# EasyEDA Pro project ProPrj_ESP32S3R8N8 CAN Board_2026-01-26.epro

# Schematic Schematic

## Sheets
1 core: Board Name: LCSC ESP32S3R8N8 Dev Board V1.0.0; Create Date: 2026-01-01; Page Name: core; Project Name: ESP32S3R8N8 CAN Board; Schematic Name: Schematic; Update Date: 2026-01-02; Company: 嘉立创EDA; Page Size: A4; Reviewed: 嘉立创EDA
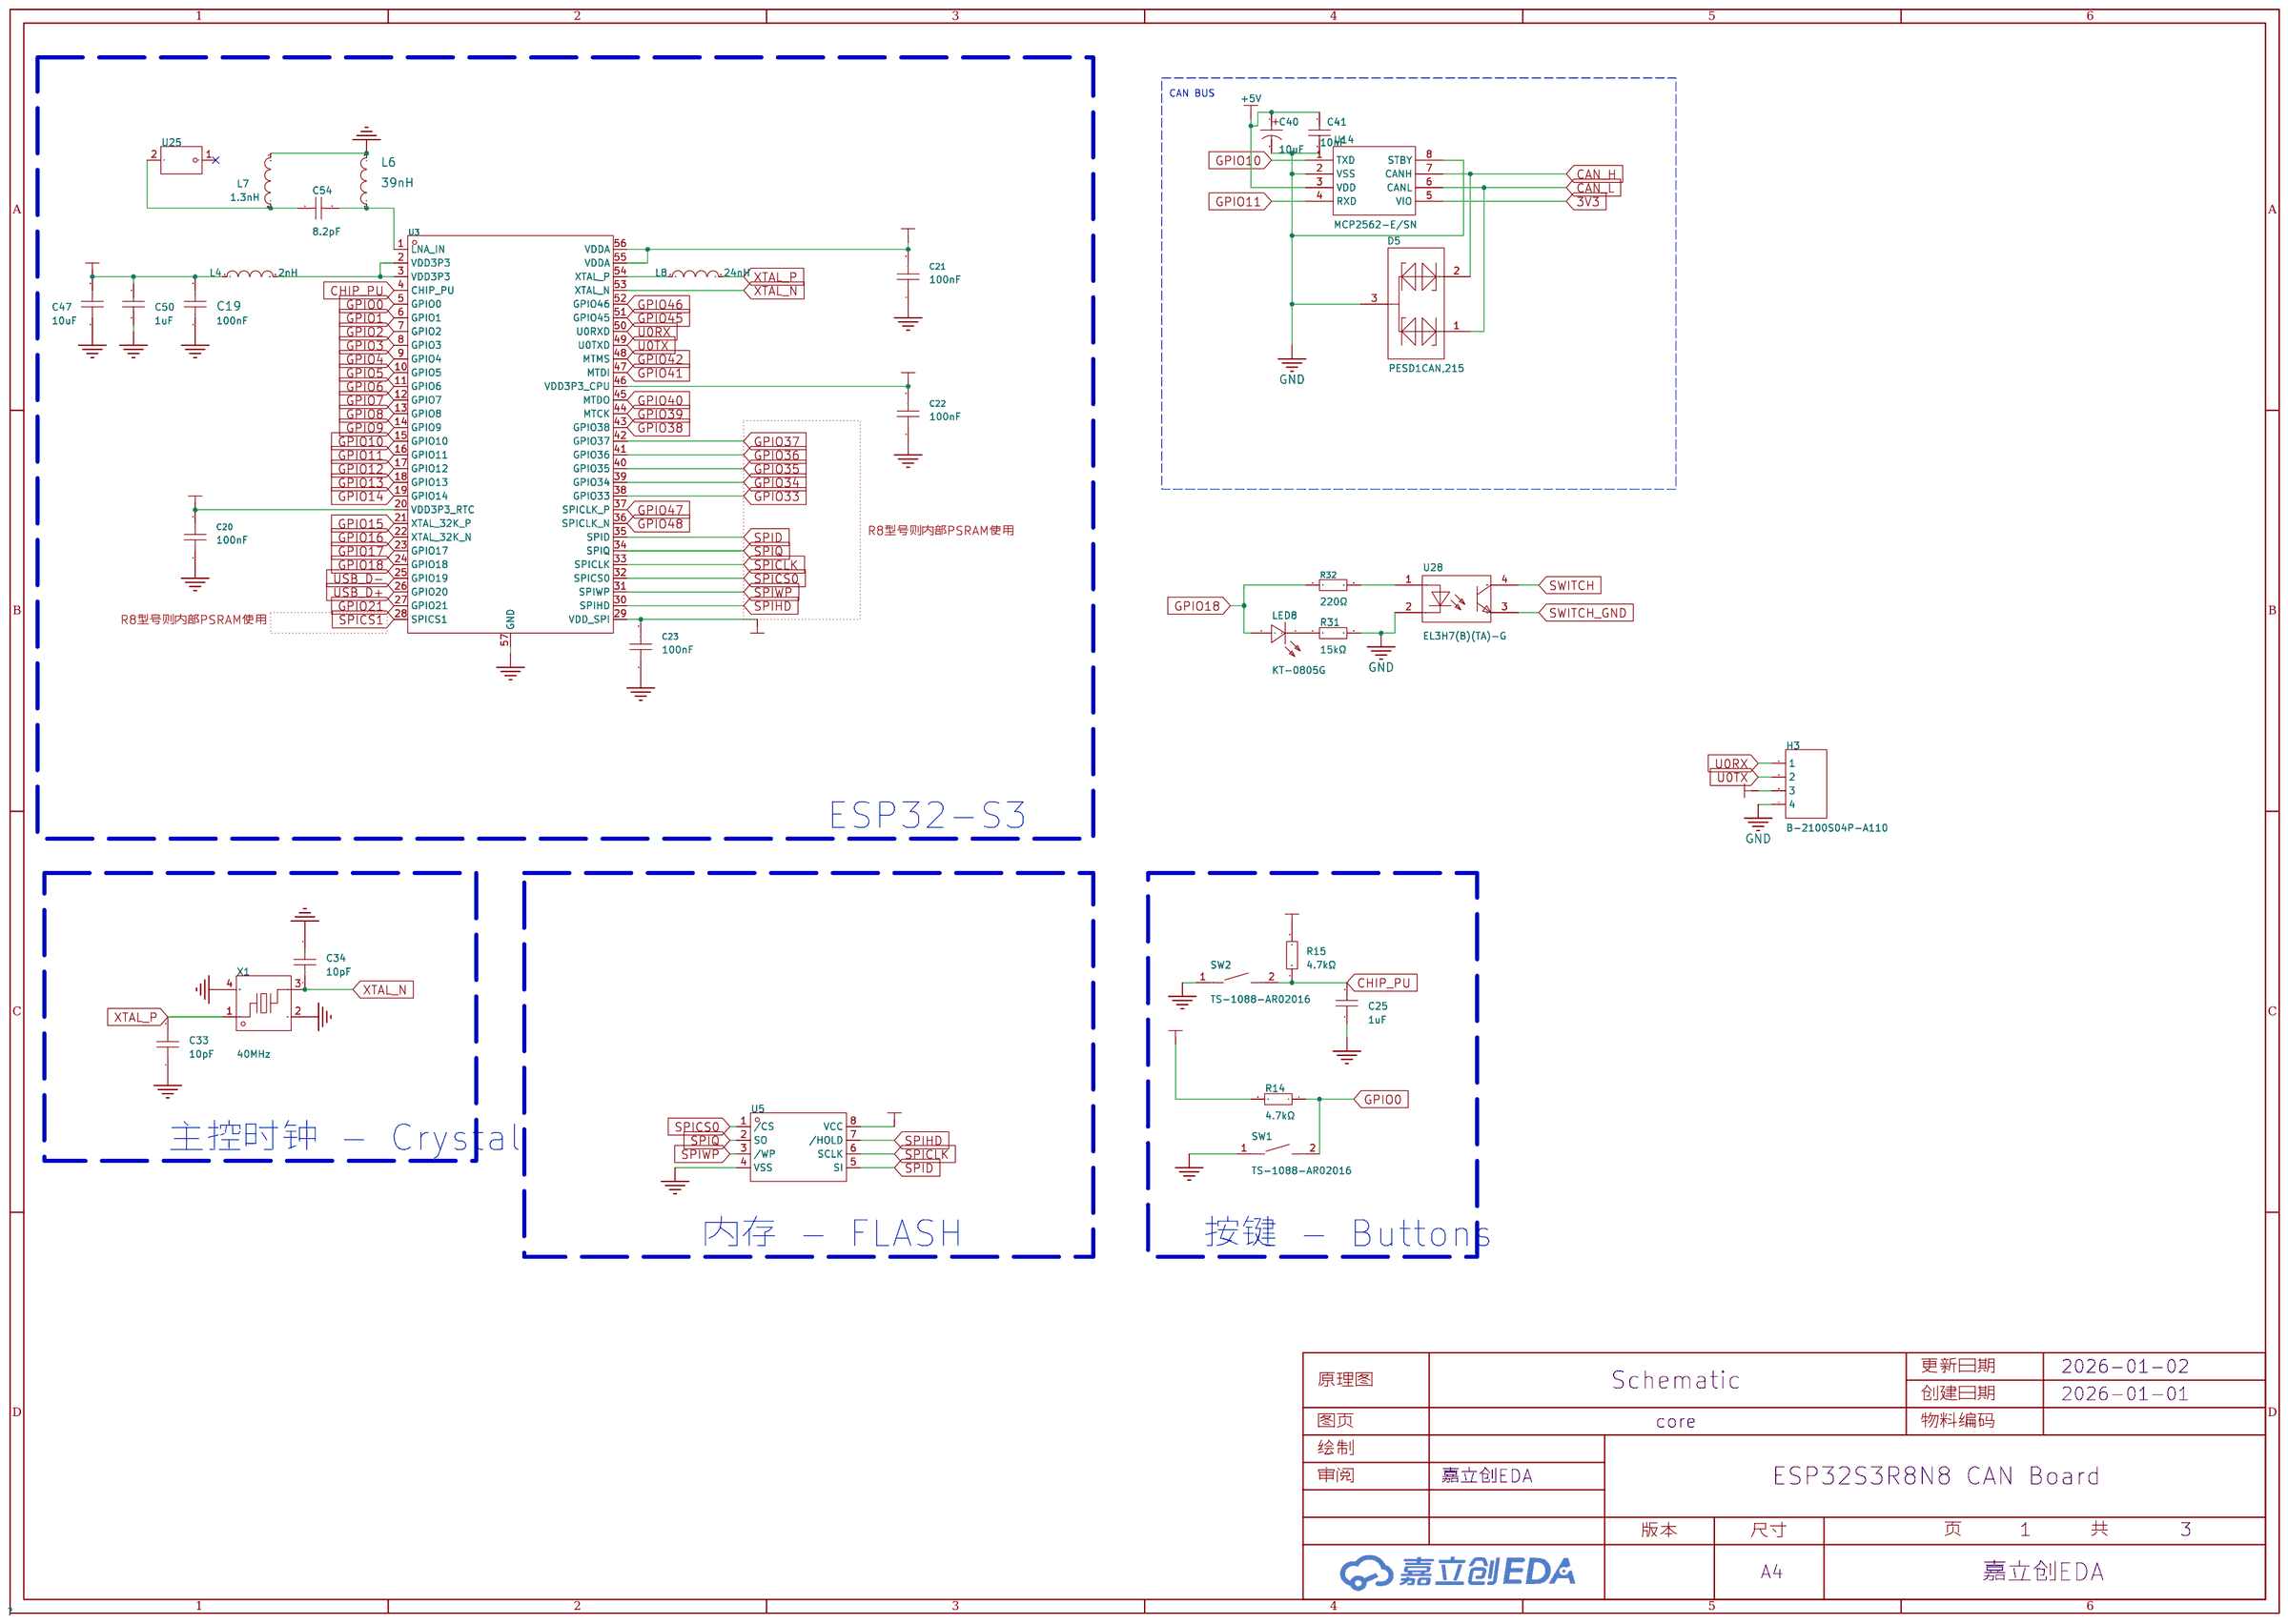
[diagram p0: core]
2 power: Page Name: power; Update Date: 2026-01-01
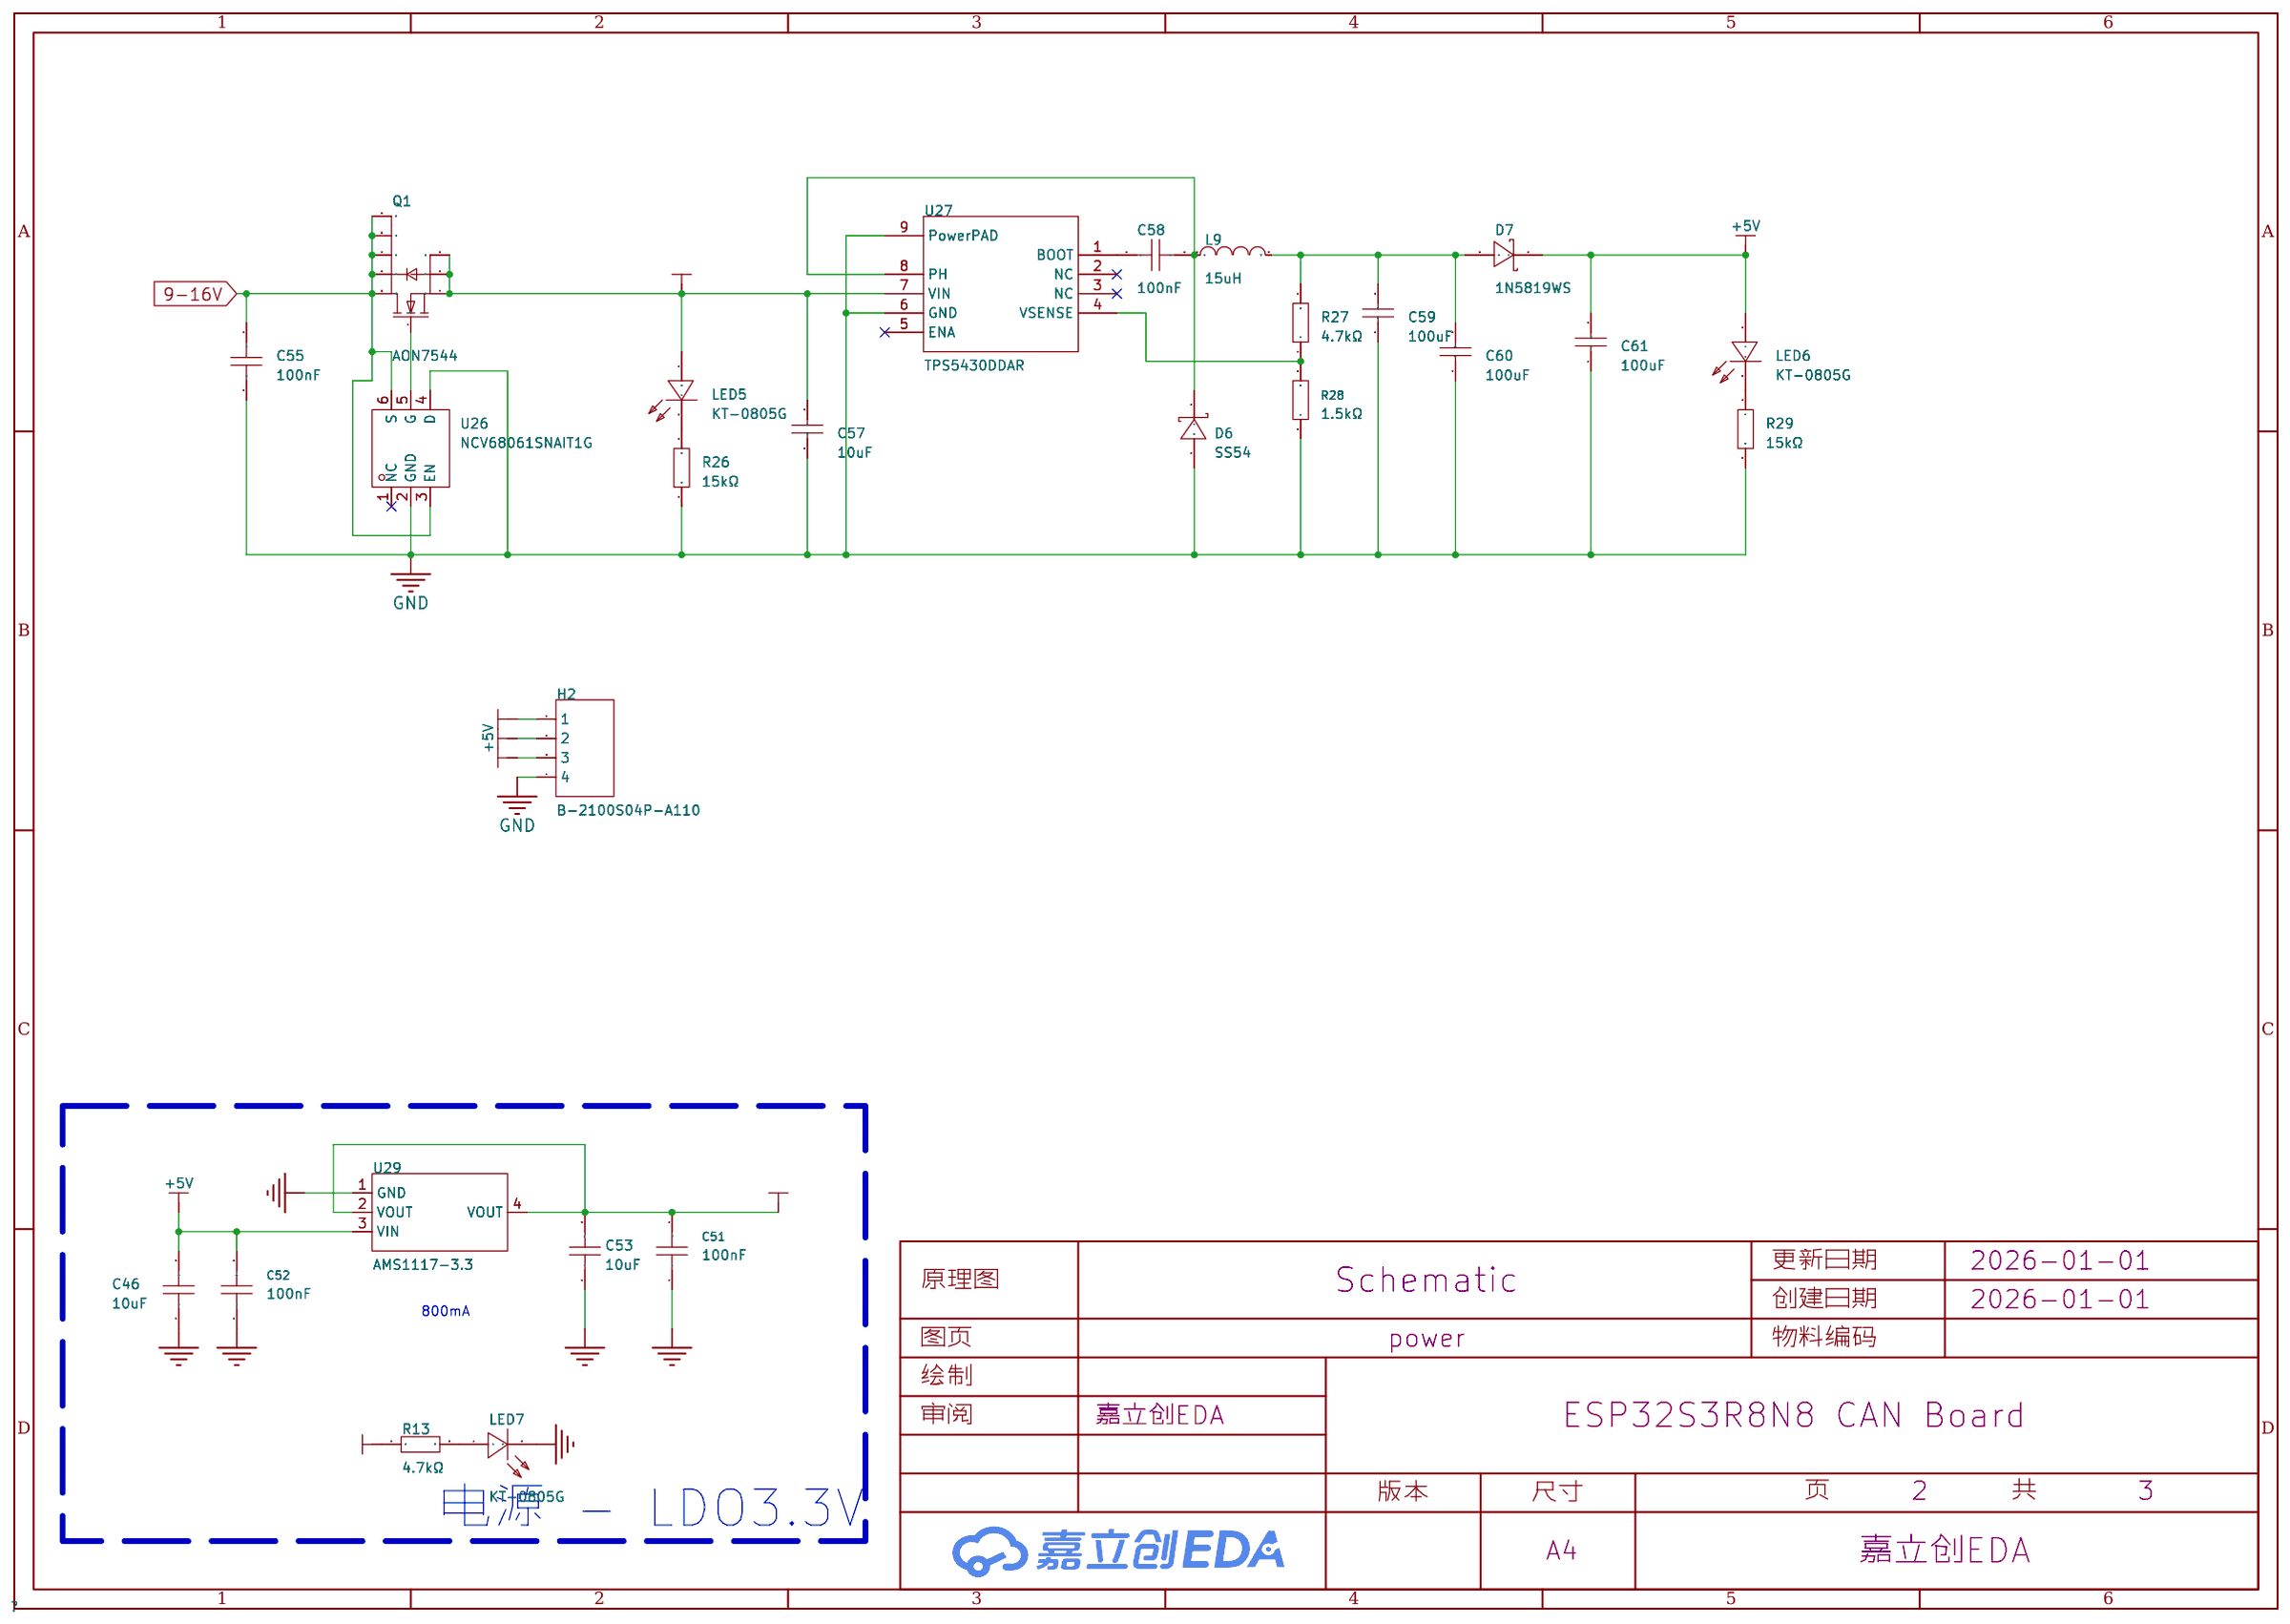
[diagram p1: power]
3 connectors: Page Name: connectors; Update Date: 2026-01-01
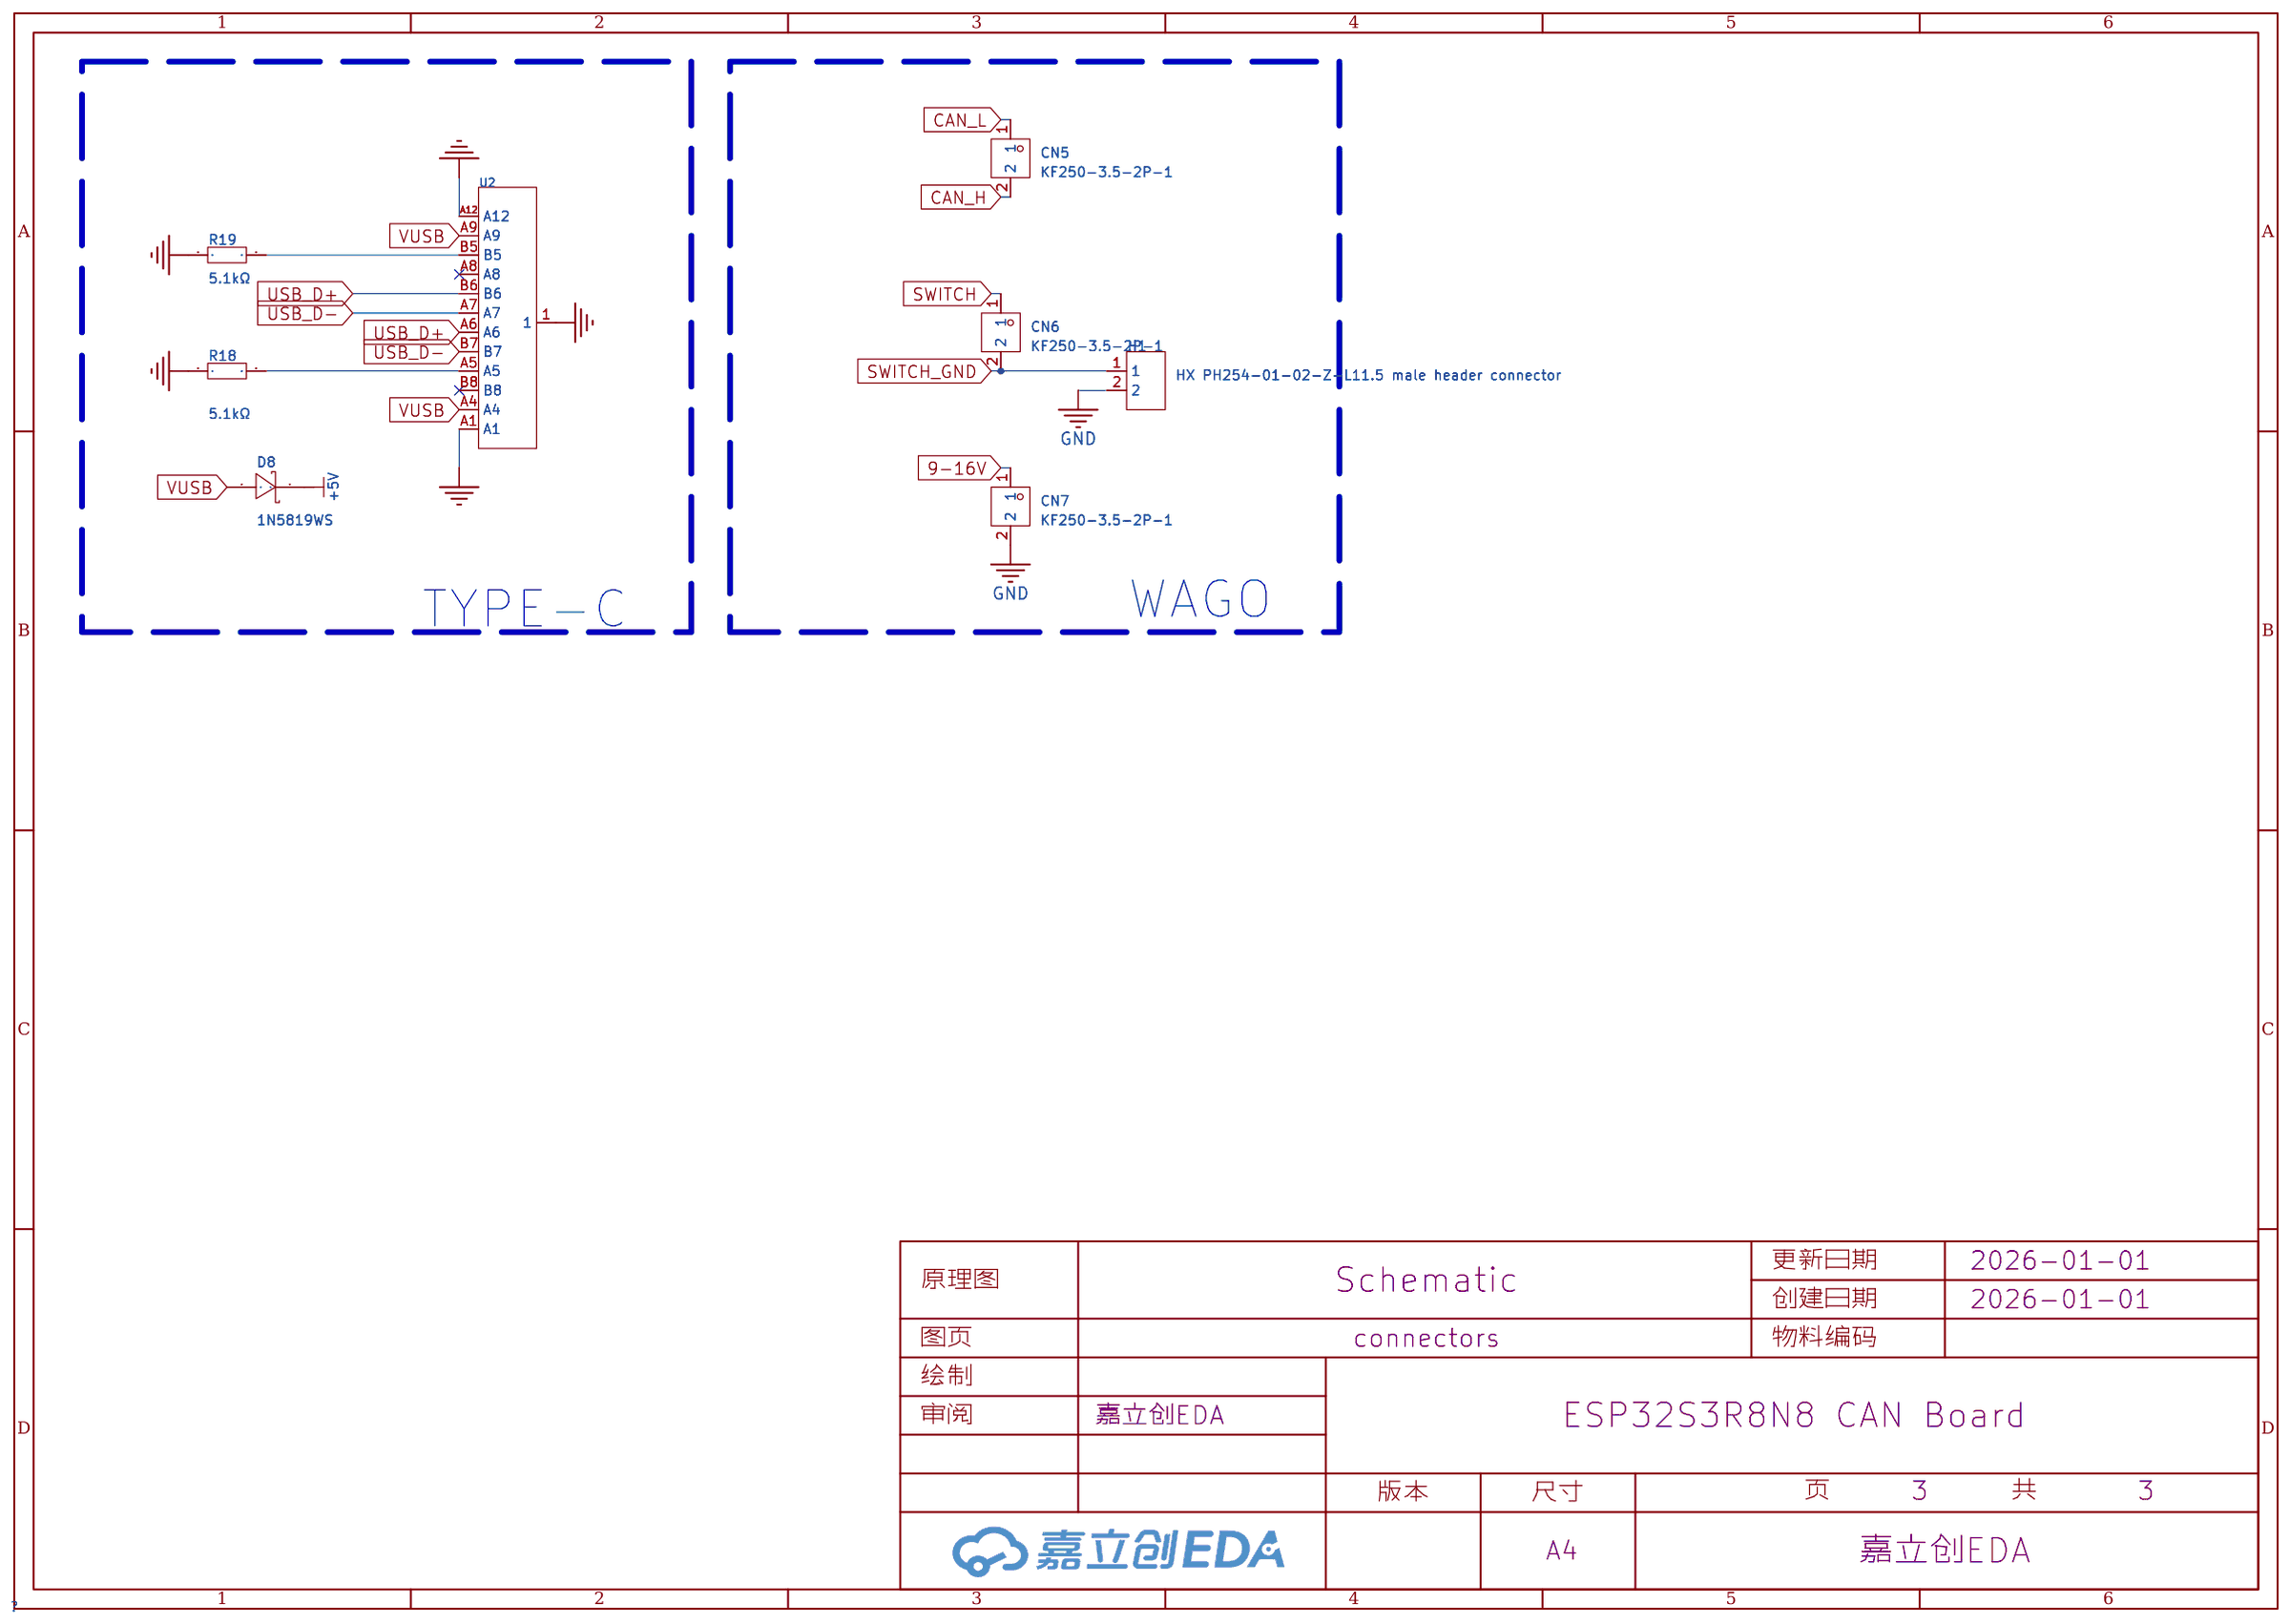
[diagram p2: connectors]

## Parts
sheet connectors
CN5  KF250-3.5-2P-1  [CONN-TH_P3.50_KF250-3.5-2P-1]
CN6  KF250-3.5-2P-1  [CONN-TH_P3.50_KF250-3.5-2P-1]
CN7  KF250-3.5-2P-1  [CONN-TH_P3.50_KF250-3.5-2P-1]
D8  1N5819WS  [SOD-323_L1.8-W1.3-LS2.5-RD]
H1  HX PH254-01-02-Z-L11.5 male header connector  [HDR-TH_2P-P2.54-V-M_C9900056156]
R18  5.1kΩ  [R0402]
R19  5.1kΩ  [R0402]
U2  USB-TYPE-C-019  [TYPE-C-SMD_HX-TYPE-C-16PIN]
sheet core
C19  100nF  [R0402]
C20  100nF  [R0402]
C21  100nF  [R0402]
C22  100nF  [R0402]
C23  100nF  [R0402]
C25  1uF  [R0402]
C33  10pF  [R0402]
C34  10pF  [R0402]
C40  10uF  [C1206]
C41  10nF  [C0402]
C47  10uF  [C1206]
C50  1uF  [R0402]
C54  8.2pF  [R0402]
D5  PESD1CAN,215  [SOT-23_L2.9-W1.3-P1.90-LS2.4-BR]
H3  B-2100S04P-A110  [HDR-TH_4P-P2.54-V-M]  (no BOM)
L4  2nH  [R0402]
L6  39nH  [R0402]
L7  1.3nH  [R0402]
L8  24nH  [R0402]
LED8  KT-0805G  [LED0805-R-RD]
R14  4.7kΩ  [R0402]
R15  4.7kΩ  [R0402]
R31  15kΩ  [R0402]
R32  220Ω  [R0402]
SW1  TS-1088-AR02016  [SW-SMD_L3.9-W3.0-P4.45]
SW2  TS-1088-AR02016  [SW-SMD_L3.9-W3.0-P4.45]
U3  ESP32-S3(R8)  [QFN-56_L7.0-W7.0-P0.40-TL-EP4.0]
U5  BY25Q64ASSIG(T)  [SOIC-8_L5.3-W5.3-P1.27-LS8.0-BL]
U14  MCP2562-E/SN  [SOIC-8_L5.0-W4.0-P1.27-LS6.0-BL]
U25  RFANT5220110A0T  [FILTER-SMD_L5.2-W2.0-L]
U28  EL3H7(B)(TA)-G  [SSOP-4_L4.4-W2.7-P1.27-LS7.0-TL]
X1  40MHz  [CRYSTAL-SMD_4P-L2.5-W2.0-BL]
sheet power
C46  10uF  [C1206]
C51  100nF  [C0603]
C52  100nF  [C0603]
C53  10uF  [C1206]
C55  100nF  [C0603]
C57  10uF  [C1206]
C58  100nF  [C0603]
C59  100uF  [C1206]
C60  100uF  [C1206]
C61  100uF  [C1206]
D6  SS54  [SMA_L4.4-W2.8-LS5.4-R-RD]
D7  1N5819WS  [SOD-323_L1.8-W1.3-LS2.5-RD]
H2  B-2100S04P-A110  [HDR-TH_4P-P2.54-V-M]  (no BOM)
L9  15uH  [IND-SMD_L7.0-W6.6_FXL0630]
LED5  KT-0805G  [LED0805-R-RD]
LED6  KT-0805G  [LED0805-R-RD]
LED7  KT-0805G  [LED0805-R-RD]
Q1  AON7544  [DFN-8_L3.2-W3.1-P0.65-LS3.4-BL]
R13  4.7kΩ  [R0402]
R26  15kΩ  [R0402]
R27  4.7kΩ  [R0402]
R28  1.5kΩ  [R0402]
R29  15kΩ  [R0402]
U26  NCV68061SNAIT1G  [TSOP-6_L3.0-W1.5-P0.95-BL]
U27  TPS5430DDAR  [ESOP-8_L4.9-W3.9-P1.27-LS6.0-TL-EP]
U29  AMS1117-3.3  [SOT-223-3_L6.5-W3.4-P2.30-LS7.0-BR]

## Library data of the parts
CN5-CN7 = KF250-3.5-2P-1: Pitch:3.5mm Mounting Style:- Number of Pins:2P Number of PINs Per Row:2 Current Rating (Max):5A Voltage Rating (Max):400V Wire Gauge - AWG:18~22 Wire Gauge - mm2:0.75; LCSC Part Name: 3.5mm 每排P数:2; Supplier Part: C475154; Manufacturer: KEFA(科发); Supplier Footprint: 插件,P=3.5mm; JLCPCB Part Class: Extended Part; Datasheet: https://atta.szlcsc.com/upload/public/pdf/source/20200115/C475171_82EB47279F399AE19B757AAC3817A41D.pdf; Supplier: LCSC; Pitch: 3.5mm; Number of Pins: 2P; Number of PINs Per Row: 2; Current Rating (Max): 5A; Voltage Rating (Max): 400V; Wire Gauge - AWG: 18~22; Wire Gauge - mm2: 0.75
D7 D8 = 1N5819WS_C191023: Voltage - Forward(Vf@If):600mV@1A Voltage - DC Reverse(Vr):40V Current - Rectified:1A Non-Repetitive Peak Forward Surge Current:25A; LCSC Part Name: 电压:40V 电流:1A; Supplier Part: C191023; Manufacturer: Hottech(合科泰); Supplier Footprint: SOD-323; JLCPCB Part Class: Basic Part; Datasheet: https://item.szlcsc.com/datasheet/1N5819WS/213850.html; Supplier: LCSC; Voltage - Forward(Vf@If): 600mV@1A; Voltage - DC Reverse(Vr): 40V; Current - Rectified: 1A; Non-Repetitive Peak Forward Surge Current: 25A
H1 = HX PH254-01-02-Z-L11.5 male header connector: Pin Structure:1x2P Pitch:2.54mm Circluar Pins/Square Pins:Pin Header Mounting Type:Through Hole Number of Rows:1 Number of Pins:2P Current Rating:3A Voltage Rating (Max):1kV Length of Mating Pin:6mm Insulation Height:2.5mm Length of End Connection Pin:3mm; LCSC Part Name: 1x2P 间距:2.54mm 方针 直插; Supplier Part: C52016390; Manufacturer: hanxia(韩下); Supplier Footprint: 插件,P=2.54mm; JLCPCB Part Class: Extended Part; Datasheet: https://item.szlcsc.com/datasheet/HX%2520PH254-01-02-Z-L11.5%2520male%2520header%2520connector/54760435.html; Supplier: LCSC; Pin Structure: 1x2P; Pitch: 2.54mm; Circluar Pins/Square Pins: Pin Header; Mounting Type: Through Hole; Number of Rows: 1; Number of Pins: 2P; Current Rating: 3A; Voltage Rating (Max): 1kV; Length of Mating Pin: 6mm; Insulation Height: 2.5mm; Length of End Connection Pin: 3mm; Contact Material: Brass; Contact Plating: Gold; Operating Temperature: -40℃~+105℃
R18 R19 = 0402WGF5101TCE: 电阻类型:厚膜电阻;阻值:5.1kΩ;精度:±1%;功率:62.5mW;; LCSC Part Name: 5.1kΩ ±1% 62.5mW; Supplier Part: C25905; Manufacturer: UNI-ROYAL(厚声); Supplier Footprint: 0402; JLCPCB Part Class: 基础库; Datasheet: https://atta.szlcsc.com/upload/public/pdf/source/20200306/C422600_1E6D84923E4A46A82E41ADD87F860B5C.pdf; Supplier: LCSC; Type: 厚膜电阻; Tolerance: ±1%; Power(Watts): 62.5mW; Temperature Coefficient: ±100ppm/℃; Overload Voltage (Max): 50V; Operating Temperature Range: -55℃~+155℃
U2 = USB-TYPE-C-019: Supplier Part: C2927039; Manufacturer: DEALON(德艺隆); Supplier Footprint: 插件; JLCPCB Part Class: 扩展库; Supplier: LCSC
C19-C23 = GRM155R71H104KE14D: 容值:100nF;精度:±10%;额定电压:50V;材质(温度系数):X7R;; LCSC Part Name: 100nF ±10% 50V; Supplier Part: C77020; Manufacturer: muRata(村田); Supplier Footprint: 0402; JLCPCB Part Class: 扩展库; Datasheet: https://atta.szlcsc.com/upload/public/pdf/source/20180326/C77020_39BD49C951FF1AF0DB1F1FAC5AC1E401.pdf; Supplier: LCSC; Tolerance: ±10%; Voltage Rated: 50V; Temperature Coefficient: X7R
C25 C50 = CL05A105KP5NNNC: 容值:1uF;精度:±10%;额定电压:10V;材质(温度系数):X5R;; LCSC Part Name: 1uF ±10% 10V; Supplier Part: C14445; Manufacturer: SAMSUNG(三星); Supplier Footprint: 0402; JLCPCB Part Class: 扩展库; Datasheet: https://atta.szlcsc.com/upload/public/pdf/source/20160103/1457707670698.pdf; Supplier: LCSC; Tolerance: ±10%; Voltage Rated: 10V; Temperature Coefficient: X5R
C33 C34 = CL05C100JB5NNNC: 容值:10pF;精度:±5%;额定电压:50V;材质(温度系数):C0G;; LCSC Part Name: 10pF ±5% 50V; Supplier Part: C32949; Manufacturer: SAMSUNG(三星); Supplier Footprint: 0402; JLCPCB Part Class: Basic Part; Datasheet: https://atta.szlcsc.com/upload/public/pdf/source/20160103/1457707722238.pdf; Supplier: LCSC; Tolerance: ±5%; Voltage Rated: 50V; Temperature Coefficient: C0G
C40 C46 C47 C53 C57 = CL31A106KBHNNNE: Capacitance:10uF Tolerance:±10% Tolerance:±10% Voltage Rating:50V Temperature Coefficient:X5R; LCSC Part Name: 10uF ±10% 50V; Supplier Part: C13585; Manufacturer: SAMSUNG(三星); Supplier Footprint: 1206; JLCPCB Part Class: Basic Part; Datasheet: https://item.szlcsc.com/datasheet/CL31A106KBHNNNE/14236.html; Supplier: LCSC; Tolerance: ±10%; Voltage Rating: 50V; Temperature Coefficient: X5R
C41 = CGA2B2X7R1E103KT0Y0F: Capacitance: Tolerance:±10% Tolerance:±10% Voltage Rated: Temperature Coefficient:; LCSC Part Name: 10nF ±10% 25V; Supplier Part: C76702; Manufacturer: TDK; Supplier Footprint: 0402; JLCPCB Part Class: Extended Part; Datasheet: https://atta.szlcsc.com/upload/public/pdf/source/20160918/1474166898203.pdf; Supplier: LCSC; Tolerance: ±10%
C54 = 0402CG8R2C500NT: 容值:8.2pF;额定电压:50V;材质(温度系数):C0G;; LCSC Part Name: 8.2pF 50V ±0.25pF; Supplier Part: C1579; Manufacturer: FH(风华); Supplier Footprint: 0402; JLCPCB Part Class: 扩展库; Datasheet: https://atta.szlcsc.com/upload/public/pdf/source/20200305/C486355_26A10D38EF8C2A5C37091D0039909270.pdf; Supplier: LCSC; Voltage Rated: 50V; Temperature Coefficient: C0G
D5 = PESD1CAN,215: Polarity:Bi-Directional Reverse Stand-Off Voltage (Vrwm):24V Breakdown Voltage (VBR):25.4V Peak Pulse Current(Ipp)@8/20us:3A Clamping Voltage@Ipp:70V Peak Pulse Power(Ppp)@8/20us:200W Junction Capacitance(Cj)@1MHz:11pF@1MHz Operating Temperature:-65℃~+150; LCSC Part Name: 双向ESD; Supplier Part: C15771; Manufacturer: Nexperia(安世); Supplier Footprint: SOT-23; JLCPCB Part Class: Extended Part; Datasheet: https://atta.szlcsc.com/upload/public/pdf/source/20130730/1457706628055.pdf; Supplier: LCSC; Polarity: Bi-Directional; Reverse Stand-Off Voltage (Vrwm): 24V; Breakdown Voltage (VBR): 25.4V; Peak Pulse Current(Ipp)@8/20us: 3A; Clamping Voltage@Ipp: 70V; Peak Pulse Power(Ppp)@8/20us: 200W; Junction Capacitance(Cj)@1MHz: 11pF@1MHz; Operating Temperature: -65℃~+150℃@(Ta)
H2 H3 = B-2100S04P-A110: Pin Structure:1x4P Pitch:2.54mm Row Spacing:- Circluar Pins/Square Pins:- Mounting Type:Through Hole Number of Rows:1 Number of Pins:4P Current Rating:- Voltage Rating (Max):- Length of Mating Pin:6mm Insulation Height:2.54mm Length of End Connection Pin:; LCSC Part Name: 2.54直排针; Supplier Part: C124378; Manufacturer: Ckmtw(灿科盟); Supplier Footprint: 插件,P=2.54mm; JLCPCB Part Class: Extended Part; Datasheet: https://item.szlcsc.com/datasheet/B-2100S04P-A110/125653.html; Supplier: LCSC; Pin Structure: 1x4P; Pitch: 2.54mm; Mounting Type: Through Hole; Number of Rows: 1; Number of Pins: 4P; Length of Mating Pin: 6mm; Insulation Height: 2.54mm; Length of End Connection Pin: 3mm; Contact Material: Brass; Operating Temperature: -40℃~+105℃; Color: Black
L4 = MLG1005S2N0BT000: 电感值:2nH;精度:-;额定电流:900mA;饱和电流(Isat):-;直流电阻(DCR):70mΩ;; LCSC Part Name: 2nH ±0.1nH; Supplier Part: C76769; Manufacturer: TDK; Supplier Footprint: 0402; JLCPCB Part Class: Extended Part; Datasheet: https://atta.szlcsc.com/upload/public/pdf/source/20160918/1474166917976.pdf; Supplier: LCSC; Rated Current: 900mA; DC Resistance (DCR): 70mΩ; Q @ Freq: 7@100MHz; Frequency - Self Resonant: 7.5GHz
L6 = SDCL1005C39NJTDF: 电感值:39nH;额定电流:200mA;直流电阻(DCR):1Ω;精度:±5%;; Supplier Part: C26443; Manufacturer: Sunlord(顺络); Supplier Footprint: 0402; JLCPCB Part Class: 扩展库; Supplier: LCSC; Rated Current: 200mA; DC Resistance (DCR): 1Ω; Tolerance: ±5%
L7 = SDCL1005C1N3STDF: 电感值:1.3nH;精度:-;额定电流:400mA;直流电阻(DCR):100mΩ;饱和电流(Isat):-;; Supplier Part: C279756; Manufacturer: Sunlord(顺络); Supplier Footprint: 0402; JLCPCB Part Class: 扩展库; Datasheet: https://atta.szlcsc.com/upload/public/pdf/source/20231027/6126A3AAC5912C34388756BE22DEE00C.pdf; Supplier: LCSC; Rated Current: 400mA; DC Resistance (DCR): 100mΩ; Q @ Freq: 8@100MHz; Frequency - Self Resonant: 10GHz
L8 = SDCL1005C24NJTDF: 电感值:24nH;精度:±5%;额定电流:-;饱和电流(Isat):-;直流电阻(DCR):-;; LCSC Part Name: 24nH ±5%; Supplier Part: C74301; Manufacturer: Sunlord(顺络); Supplier Footprint: 0402; JLCPCB Part Class: 扩展库; Datasheet: https://atta.szlcsc.com/upload/public/pdf/source/20210916/2389196E6DC4CA1121B2D3610B126F46.pdf; Supplier: LCSC; Tolerance: ±5%
LED5-LED8 = KT-0805G: Lamp Holder Type:- Illumination Color:Emerald Green Voltage - Forward(Vf):2.6V~3.1V Voltage - Forward(Vf):2.6V~3.1V Power(Watts):100mW Forward Current:5mA Wavelength - Dominant:513nm~528nm Wavelength - Dominant:513nm~528nm Peak Wavelength:525nm Diode Conf; LCSC Part Name: 0805 翠绿 高亮; Supplier Part: C2297; Manufacturer: KENTO; Supplier Footprint: 0805; JLCPCB Part Class: Basic Part; Datasheet: https://item.szlcsc.com/datasheet/KT-0805G/2670.html; Supplier: LCSC; Illumination Color: Emerald Green; Voltage - Forward(Vf): 2.6V~3.1V; Power(Watts): 100mW; Forward Current: 5mA; Wavelength - Dominant: 513nm~528nm; Peak Wavelength: 525nm; Luminous Intensity: 430mcd; Viewing Angle: 120°; Operating Temperature: -40℃~+85℃
R13-R15 R27 = 0402WGF4701TCE: Type:Thick Film Resistor Resistance:4.7kΩ Tolerance:±1% Tolerance:±1% Power(Watts):62.5mW Voltage-Supply(Max):50V Temperature Coefficient:±100ppm/℃ Temperature Coefficient:±100ppm/℃ Operating Temperature:-55℃~+155℃ Operating Temperature:-55℃~+155℃; LCSC Part Name: 4.7kΩ ±1% 62.5mW 厚膜电阻; Supplier Part: C25900; Manufacturer: UNI-ROYAL(厚声); Supplier Footprint: 0402; JLCPCB Part Class: Basic Part; Datasheet: https://item.szlcsc.com/datasheet/0402WGF4701TCE/26643.html; Supplier: LCSC; Type: Thick Film Resistor; Tolerance: ±1%; Power(Watts): 62.5mW; Voltage-Supply(Max): 50V; Temperature Coefficient: ±100ppm/℃; Operating Temperature: -55℃~+155℃
R26 R29 R31 = 0402WGF1502TCE: 电阻类型:厚膜电阻;阻值:15kΩ;精度:±1%;功率:62.5mW;; LCSC Part Name: 15kΩ ±1% 62.5mW; Supplier Part: C25756; Manufacturer: UNI-ROYAL(厚声); Supplier Footprint: 0402; JLCPCB Part Class: Basic Part; Datasheet: https://atta.szlcsc.com/upload/public/pdf/source/20200306/C422600_1E6D84923E4A46A82E41ADD87F860B5C.pdf; Supplier: LCSC; Type: 厚膜电阻; Tolerance: ±1%; Power(Watts): 62.5mW; Temperature Coefficient: ±100ppm/℃; Overload Voltage (Max): 50V; Operating Temperature Range: -55℃~+155℃
R32 = 0402WGF2200TCE: Type:Thick Film Resistor Resistance:220Ω Tolerance:±1% Tolerance:±1% Power(Watts):62.5mW Voltage-Supply(Max):50V Temperature Coefficient:±100ppm/℃ Temperature Coefficient:±100ppm/℃ Operating Temperature:-55℃~+155℃ Operating Temperature:-55℃~+155℃; LCSC Part Name: 220Ω ±1% 62.5mW 厚膜电阻; Supplier Part: C25091; Manufacturer: UNI-ROYAL(厚声); Supplier Footprint: 0402; JLCPCB Part Class: Basic Part; Datasheet: https://item.szlcsc.com/datasheet/0402WGF2200TCE/25834.html; Supplier: LCSC; Type: Thick Film Resistor; Tolerance: ±1%; Power(Watts): 62.5mW; Voltage-Supply(Max): 50V; Temperature Coefficient: ±100ppm/℃; Operating Temperature: -55℃~+155℃
SW1 SW2 = TS-1088-AR02016: Circuit:SPST Actuator Style:Round Button Operating Force:1.6N Mounting Type:Surface Mount,Vertical Length:4mm Width:3mm Switch Height:2mm with Bracket:Without Bracket Contact Current:50mA Voltage Rating:12V Actuator/Cap Color:Black Termination Style:SMD(S; LCSC Part Name: 4*3*2mm 立贴 轻触开关; Supplier Part: C720477; Manufacturer: XUNPU(讯普); Supplier Footprint: SMD,4x3mm; JLCPCB Part Class: Basic Part; Datasheet: https://item.szlcsc.com/datasheet/TS-1088-AR02016/763484.html; Supplier: LCSC; Circuit: SPST; Actuator Style: Round Button; Operating Force: 1.6N; Mounting Type: Surface Mount,Vertical; Length: 4mm; Width: 3mm; Switch Height: 2mm; with Bracket: Without Bracket; Contact Current: 50mA; Voltage Rating: 12V; Actuator/Cap Color: Black; Termination Style: SMD(SMT) Tab; Life: 100,000 Cycles; Operating Temperature: -30℃~+80℃
U3 = ESP32-S3(R8): 应用领域:蓝牙,WiFi;频率范围:2.412GHz~2.484GHz;数据速率:150Mbps;灵敏度:-98.4dBm;接口:I2C,I2S,SPI,UART,USB;; Supplier Part: C2913194; Manufacturer: ESPRESSIF(乐鑫); Supplier Footprint: QFN-56(7x7); JLCPCB Part Class: 扩展库; Supplier: LCSC; Applications: 蓝牙,WiFi; Operating Voltage: 3.3V; Frequency Range: 2.412GHz~2.484GHz; Data Rate: 150Mbps; Sensitivity: -98.4dBm; Interface: I2C,I2S,SPI,UART,USB; Output Power: 21dBm; Operating Temperature: -40℃~+85℃
U5 = BY25Q64ASSIG(T): Supplier Part: C484306; Manufacturer: BOYAMICRO(博雅); Supplier Footprint: SOIC-8-208mil; JLCPCB Part Class: 扩展库; Datasheet: https://atta.szlcsc.com/upload/public/pdf/source/20200115/C484306_247CE91A1CD6630E225A23B41696B60B.pdf; Supplier: LCSC
U14 = MCP2562-E/SN: Type:Transceiver Supply Voltage:4.5V~5.5V Supply Voltage:4.5V~5.5V; LCSC Part Name: 4.5V~5.5V; Supplier Part: C53609; Manufacturer: MICROCHIP(美国微芯); Supplier Footprint: SOIC-8; JLCPCB Part Class: ExtendedPart; Datasheet: https://atta.szlcsc.com/upload/public/pdf/source/20150713/1457707330677.pdf; Supplier: LCSC; Type: Transceiver; Supply Voltage: 4.5V~5.5V
U25 = RFANT5220110A0T: 2.4 GHz 陶瓷天线; Supplier Part: C127611; Manufacturer: Walsin(华新科); Supplier Footprint: SMD,2x5.2mm; JLCPCB Part Class: 扩展库; Datasheet: https://atta.szlcsc.com/upload/public/pdf/source/20180326/C127611_CAA3DCCF3A021118096CAD99FC50242A.pdf; Supplier: LCSC
U28 = EL3H7(B)(TA)-G_C5213653: Input type:DC Output Type:Phototransistor Voltage - Forward(Vf):1.2V Output Current:50mA Isolation Voltage(Vrms):3.75kV Reverse Voltage:6V Load Voltage:80V Vce Saturation(VCE(sat)):200mV@10mA,1mA Rise time:5us Fall time:3us Operating Temperature:-55℃~+110; LCSC Part Name: 4引脚SSOP封装光电晶体管光电耦合器; Supplier Part: C5213653; Manufacturer: EVERLIGHT(亿光); Supplier Footprint: SSOP-4-1.27mm; JLCPCB Part Class: Extended Part; Datasheet: https://www.everlighteurope.com/custom/files/datasheets/DPC-0000031.pdf; Supplier: LCSC; Input type: DC; Output Type: Phototransistor; Voltage - Forward(Vf): 1.2V; Output Current: 50mA; Isolation Voltage(Vrms): 3.75kV; Reverse Voltage: 6V; Load Voltage: 80V; Vce Saturation(VCE(sat)): 200mV@10mA,1mA; Rise time: 5us; Fall time: 3us; Operating Temperature: -55℃~+110℃; Current Transfer Ratio (CTR) Minimum: 130%; Current Transfer Ratio (CTR) Maximum/Saturation Value: 260%; Forward Current(If): 50mA
X1 = S2240000101050JY: 频率:40MHz;频率公差:±10ppm;负载电容:10pF;; LCSC Part Name: 40MHz ±10ppm 内置负载电容:10pF; Supplier Part: C2885592; Manufacturer: JGHC(晶光华); Supplier Footprint: SMD2520-4P; JLCPCB Part Class: 扩展库; Datasheet: https://atta.szlcsc.com/upload/public/pdf/source/20191012/C426971_E72B01839CFBB8D8B48FED2AC1315BE2.pdf; Supplier: LCSC; Crystal Type: 贴片无源晶振; Frequency Tolerance: ±10ppm; Load Capacitance: 10pF; Equivalent Series Resistance (ESR): 50Ω; Operating Temperature: -40℃~+85℃
C51 C52 C55 C58 = CC0603KRX7R9BB104: Capacitance:100nF Tolerance:±10% Tolerance:±10% Voltage Rating:50V Temperature Coefficient:X7R; LCSC Part Name: 100nF ±10% 50V; Supplier Part: C14663; Manufacturer: YAGEO(国巨); Supplier Footprint: 0603; JLCPCB Part Class: Basic Part; Datasheet: https://item.szlcsc.com/datasheet/CC0603KRX7R9BB104/15331.html; Supplier: LCSC; Tolerance: ±10%; Voltage Rating: 50V; Temperature Coefficient: X7R
C59-C61 = CL31A107MQHNNNE: Capacitance:100uF Tolerance:±20% Tolerance:±20% Voltage Rating:6.3V Temperature Coefficient:X5R; LCSC Part Name: 100uF ±20% 6.3V; Supplier Part: C15008; Manufacturer: SAMSUNG(三星); Supplier Footprint: 1206; JLCPCB Part Class: Basic Part; Datasheet: https://item.szlcsc.com/datasheet/CL31A107MQHNNNE/15681.html; Supplier: LCSC; Tolerance: ±20%; Voltage Rating: 6.3V; Temperature Coefficient: X5R
D6 = SS54_C22452: Diode Configuration:Independent Voltage - Forward(Vf@If):550mV@5A Voltage - DC Reverse(Vr):40V Current - Rectified:5A Reverse Leakage Current (Ir):1mA@40V Operating Junction Temperature Range:-55℃~+125℃ Operating Junction Temperature Range:-55℃~+125℃; LCSC Part Name: 电压:40V 电流:5A; Supplier Part: C22452; Manufacturer: MDD(辰达半导体); Supplier Footprint: SMA(DO-214AC); JLCPCB Part Class: Basic Part; Datasheet: https://item.szlcsc.com/datasheet/SS54/23178.html; Supplier: LCSC; Diode Configuration: Independent; Voltage - Forward(Vf@If): 550mV@5A; Voltage - DC Reverse(Vr): 40V; Current - Rectified: 5A; Reverse Leakage Current (Ir): 1mA@40V; Operating Junction Temperature Range: -55℃~+125℃
L9 = FXL0630-150-M: Inductance:15uH Tolerance:±20% Tolerance:±20% Current Rating:3A Current - Saturation(Isat):4A DC Resistance(DCR):115mΩ Type:Molded Inductor Ratings:-; LCSC Part Name: 15uH ±20%; Supplier Part: C177243; Manufacturer: cjiang(长江微电); Supplier Footprint: SMD,7x6.6mm; JLCPCB Part Class: Extended Part; Datasheet: https://item.szlcsc.com/datasheet/FXL0630-150-M/188635.html; Supplier: LCSC; Tolerance: ±20%; Current Rating: 3A; Current - Saturation(Isat): 4A; DC Resistance(DCR): 115mΩ; Type: Molded Inductor
Q1 = AON7544_C5261066: Number:1 N-Channel Drain to Source Voltage:30V Current - Continuous Drain(Id):100A RDS(on):5.5mΩ@10V,30A Pd - Power Dissipation:62.5W Gate Threshold Voltage (Vgs(th)):2.5V Gate Charge(Qg):31.6nC@4.5V Input Capacitance(Ciss):3.075nF@15V Reverse Transfer Ca; LCSC Part Name: 1个N沟道 耐压:30V 电流:100A; Supplier Part: C5261066; Manufacturer: HXY MOSFET(华轩阳电子); Supplier Footprint: DFN3x3-8L; JLCPCB Part Class: Extended Part; Datasheet: https://item.szlcsc.com/datasheet/AON7544/5983765.html; Supplier: LCSC; Number: 1 N-Channel; Drain to Source Voltage: 30V; Current - Continuous Drain(Id): 100A; RDS(on): 5.5mΩ@10V,30A; Pd - Power Dissipation: 62.5W; Gate Threshold Voltage (Vgs(th)): 2.5V; Gate Charge(Qg): 31.6nC@4.5V; Input Capacitance(Ciss): 3.075nF@15V; Reverse Transfer Capacitance (Crss@Vds): 315pF@15V; Operating Temperature: -55℃~+150℃
R28 = 0402WGF1501TCE: Type:Thick Film Resistors Resistance:1.5kΩ Tolerance:±1% Tolerance:±1% Power(Watts): Overload Voltage (Max): Temperature Coefficient:±100ppm/℃ Temperature Coefficient:±100ppm/℃ Operating Temperature Range:-55℃~+155℃ Operating Temperature Range:-55℃~+155℃; LCSC Part Name: 1.5kΩ ±1% 62.5mW 厚膜电阻; Supplier Part: C25867; Manufacturer: UNI-ROYAL(厚声); Supplier Footprint: 0402; JLCPCB Part Class: Basic Part; Datasheet: https://atta.szlcsc.com/upload/public/pdf/source/20200306/C422600_1E6D84923E4A46A82E41ADD87F860B5C.pdf; Supplier: LCSC; Type: Thick Film Resistors; Tolerance: ±1%; Temperature Coefficient: ±100ppm/℃; Operating Temperature Range: -55℃~+155℃
U26 = NCV68061SNAIT1G: LCSC Part Name: NCV68061: Ideal Diode NMOS Controller; Supplier Part: C5206748; Manufacturer: onsemi(安森美); Supplier Footprint: TSOP-6; JLCPCB Part Class: Extended Part; Datasheet: https://item.szlcsc.com/datasheet/NCV68061SNAIT1G/5898869.html; Supplier: LCSC
U27 = TPS5430DDAR: Function:Buck Voltage - Supply:5.5V~36V Voltage - Supply:5.5V~36V Output Voltage:1.221V~32.04V Output Voltage:1.221V~32.04V Output Current:3A Frequency - Switching:500kHz Frequency - Switching:500kHz Operating Temperature:-40℃~+125℃@(TJ) Operating Tempera; LCSC Part Name: 宽输入范围、3A输出电流的降压转换器; Supplier Part: C9864; Manufacturer: TI(德州仪器); Supplier Footprint: SOIC-8-EP; JLCPCB Part Class: Basic Part; Datasheet: https://www.ti.com/lit/ds/symlink/tps5430.pdf; Supplier: LCSC; Function: Buck; Voltage - Supply: 5.5V~36V; Output Voltage: 1.221V~32.04V; Output Current: 3A; Frequency - Switching: 500kHz; Operating Temperature: -40℃~+125℃@(TJ); Synchronous Rectifier: No; Number of Outputs: 1; Topology: Buck; Quiescent Current: 4.4mA; Switch tube (built-in/external): Built-In; Output Type: Adjustable
U29 = AMS1117-3.3_C6186: Output Type:Fixed Voltage - Supply:16V Output Voltage:3.3V Output Voltage:3.3V Output Current:1A Power Supply Rejection Ratio (PSRR):72dB@(120Hz) Voltage Dropout:1.1V@(800mA) standby current:5mA Noise:0.003%Vout Features:Over Current Protection；Over Tempe; LCSC Part Name: 输出3.3V 1A; Supplier Part: C6186; Manufacturer: AMS; Supplier Footprint: SOT-223; JLCPCB Part Class: Basic Part; Datasheet: https://item.szlcsc.com/datasheet/AMS1117-3.3/6652.html; Supplier: LCSC; Output Type: Fixed; Voltage - Supply: 16V; Output Voltage: 3.3V; Output Current: 1A; Power Supply Rejection Ratio (PSRR): 72dB@(120Hz); Voltage Dropout: 1.1V@(800mA); standby current: 5mA; Noise: 0.003%Vout; Features: Over Current Protection；Over Temperature Protection; Operating Temperature: -40℃~+125℃; Output Configuration: Positive; Number of Outputs: 1

## Nets
3V3: C19.2 C20.2 C21.2 C22.2 C47.2 C50.2 C51.2 C53.2 H2.3 H3.3 L4.1 R13.1 R14.2 R15.2 U3.20(VDD3P3_RTC) U3.46(VDD3P3_CPU) U3.55(VDDA) U3.56(VDDA) U14.5(VIO) U29.2(VOUT) U29.4(VOUT)
+5V: C40.1 C41.2 C46.2 C52.2 C61.2 D7.1(K) D8.1(K) H2.2 LED6.1(A) U14.3(VDD) U29.3(VIN)
+12V: C57.2 H2.1 LED5.1(A) Q1.1(S) Q1.2(S) Q1.3(S) U27.7(VIN)
GND: C19.1 C20.1 C21.1 C22.1 C23.1 C25.1 C33.1 C34.2 C40.2 C41.1 C46.1 C47.1 C50.1 C51.1 C52.1 C53.1 C55.1 C57.1 C59.1 C60.1 C61.1 CN7.2 D5.3 D6.1(A) H1.2 H2.4 H3.4 L6.2 L7.2 LED7.2(K) R18.1 R19.1 R26.2 R28.1 R29.2 R31.2 SW1.1 SW2.1 U2.1 U2.A1 U2.A12 U3.57(GND) U5.4(VSS) U14.2(VSS) U14.8(STBY) U26.2(GND) U26.4(D) U27.6(GND) U27.9(PowerPAD) U28.2(Cathode) U29.1(GND) X1.2(GND) X1.4(GND)
VDD_SPI: C23.2 U3.29(VDD_SPI) U5.8(VCC)
9-16V: C55.2 CN7.1 Q1.5(D) Q1.6(D) Q1.7(D) Q1.8(D) Q1.9(D) U26.3(EN) U26.6(S)
CAN_H: CN5.2 D5.2 U14.7(CANH)
CAN_L: CN5.1 D5.1 U14.6(CANL)
CHIP_PU: C25.2 R15.1 SW2.2 U3.4(CHIP_PU)
GPIO0: R14.1 SW1.2 U3.5(GPIO0)
GPIO1: U3.6(GPIO1)
GPIO2: U3.7(GPIO2)
GPIO3: U3.8(GPIO3)
GPIO4: U3.9(GPIO4)
GPIO5: U3.10(GPIO5)
GPIO6: U3.11(GPIO6)
GPIO7: U3.12(GPIO7)
GPIO8: U3.13(GPIO8)
GPIO9: U3.14(GPIO9)
GPIO10: U3.15(GPIO10) U14.1(TXD)
GPIO11: U3.16(GPIO11) U14.4(RXD)
GPIO12: U3.17(GPIO12)
GPIO13: U3.18(GPIO13)
GPIO14: U3.19(GPIO14)
GPIO15: U3.21(XTAL_32K_P)
GPIO16: U3.22(XTAL_32K_N)
GPIO17: U3.23(GPIO17)
GPIO18: LED8.1(A) R32.1 U3.24(GPIO18)
GPIO21: U3.27(GPIO21)
GPIO33: U3.38(GPIO33)
GPIO34: U3.39(GPIO34)
GPIO35: U3.40(GPIO35)
GPIO36: U3.41(GPIO36)
GPIO37: U3.42(GPIO37)
GPIO38: U3.43(GPIO38)
GPIO39: U3.44(MTCK)
GPIO40: U3.45(MTDO)
GPIO41: U3.47(MTDI)
GPIO42: U3.48(MTMS)
GPIO45: U3.51(GPIO45)
GPIO46: U3.52(GPIO46)
GPIO47: U3.37(SPICLK_P)
GPIO48: U3.36(SPICLK_N)
SPICLK: U3.33(SPICLK) U5.6(SCLK)
SPICS0: U3.32(SPICS0) U5.1(/CS)
SPICS1: U3.28(SPICS1)
SPID: U3.35(SPID) U5.5(SI)
SPIHD: U3.30(SPIHD) U5.7(/HOLD)
SPIQ: U3.34(SPIQ) U5.2(SO)
SPIWP: U3.31(SPIWP) U5.3(/WP)
SWITCH: CN6.1 U28.4(Collector)
SWITCH_GND: CN6.2 H1.1 U28.3(Emitter)
U0RX: H3.1 U3.50(U0RXD)
U0TX: H3.2 U3.49(U0TXD)
USB_D+: U2.A6 U2.B6 U3.26(GPIO20)
USB_D-: U2.A7 U2.B7 U3.25(GPIO19)
VUSB: D8.2(A) U2.A4 U2.A9
XTAL_N: C34.1 U3.53(XTAL_N) X1.3
XTAL_P: C33.2 L8.2 X1.1
$1N15135: L4.2 U3.2(VDD3P3) U3.3(VDD3P3)
$1N27024: C54.2 L6.1 U3.1(LNA_IN)
$1N27033: C54.1 L7.1 U25.2
$1N27209: L8.1 U3.54(XTAL_P)
$1N43290: R32.2 U28.1(Anode)
$2N732: Q1.4(G) U26.5(G)
$2N1490: C58.1 U27.1(BOOT)
$2N1528: C58.2 D6.2(K) L9.1 U27.8(PH)
$2N1537: R27.1 R28.2 U27.4(VSENSE)
$2N1737: C59.2 C60.2 D7.2(A) L9.2 R27.2
$2N3472: LED5.2(K) R26.1
$2N3518: LED6.2(K) R29.1
$2N3567: LED7.1(A) R13.2
$3N397: R18.2 U2.A5
$3N411: R19.2 U2.B5
Net-(LED8-2): LED8.2(K) R31.1

Not connected (* = marked no-connect by the designer): U2 A8* B8*; U25 1*; U26 1(NC)*; U27 2(NC)* 3(NC)* 5(ENA)*

## Notes on the sheets
sheet 1
- CAN BUS
- R8型号则内部PSRAM使用
- R8型号则内部PSRAM使用
- ESP32-S3
- 主控时钟 - Crystal
- 内存 - FLASH
- 按键 - Buttons
sheet 2
- 800mA
- 电源 - LDO3.3V
sheet 3
- TYPE-C
- WAGO

# Board PCB
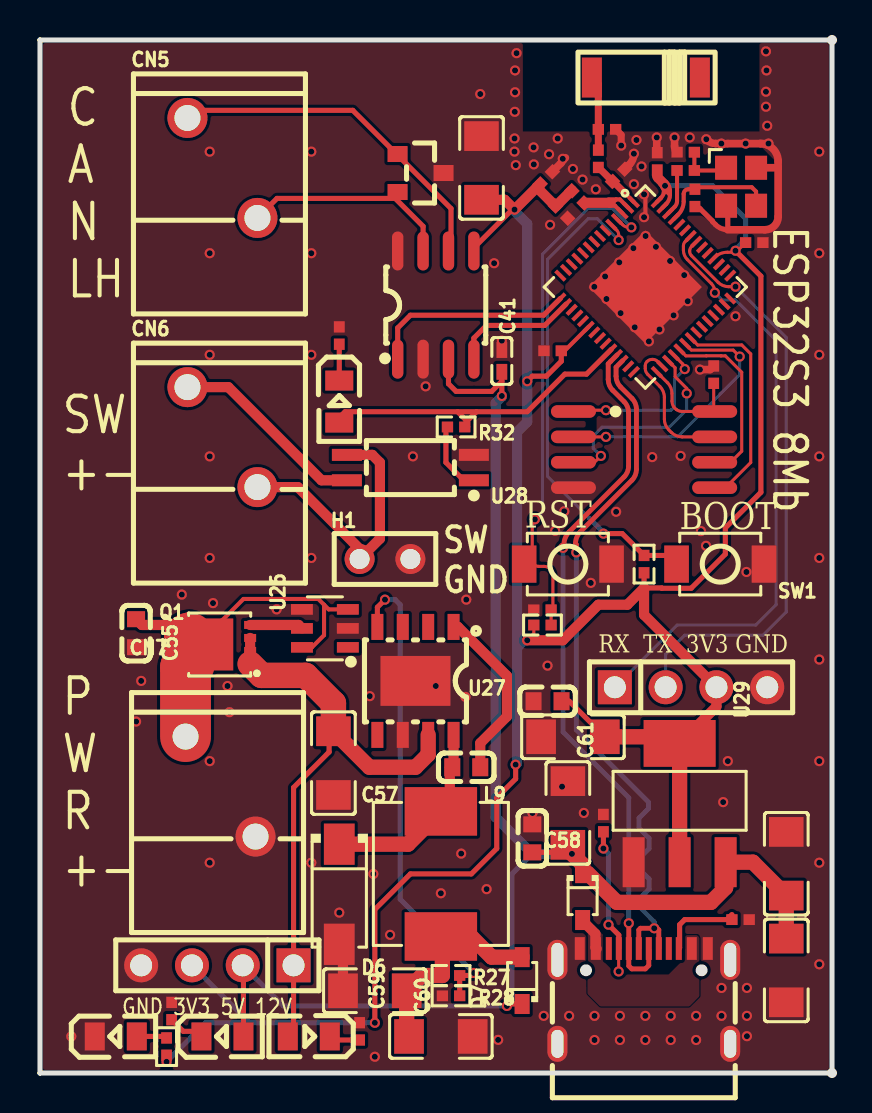
[diagram p3: board, top side]
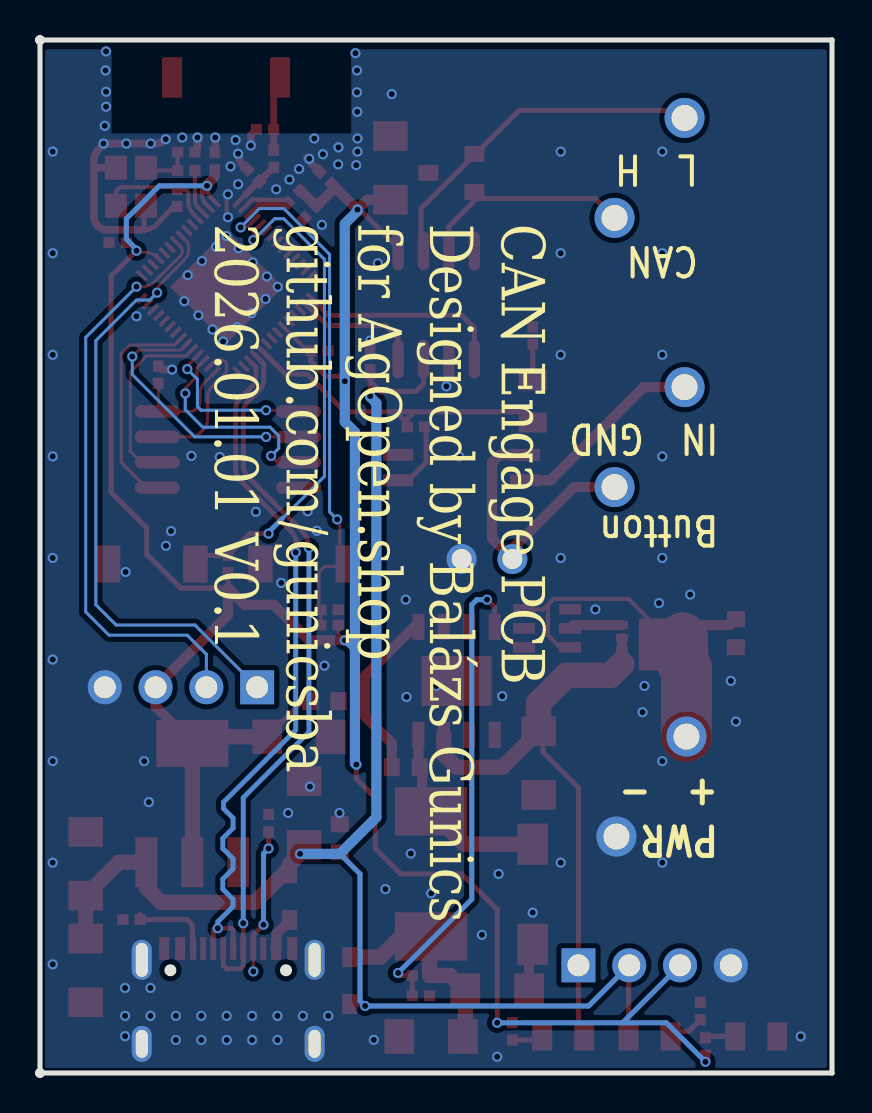
[diagram p4: board, bottom side, seen from below]

Outline 39.6 x 51.66 mm; copper layers: Top Layer, Bottom Layer. Coordinates in mm from the lower left corner of the outline.
Outline path: 0,51.66 0,0 39.6,0 39.6,51.66 0,51.66
Stack: Top Layer 0.035mm / Dielectric1 1.51mm FR4 er 4.5 / Bottom Layer 0.035mm

## Design rules (mm)
net USB_D-: DP1
net USB_D+: DP1
template: 自定义配置
spacing copperThickness1oz (default): track to track 0.102, other pairs 0 to 0.3
spacing copperThickness2oz: track to track 0.203, other pairs 0.152 to 0.3
track width copperThickness1oz (default): min 0.152, default 0.203, max 2.54
track width copperThickness2oz: min 0.203, default 0.254, max 2.54
differential pair 90Ω (default): width min 0.241, default 0.241, max 0.241; gap min 0.152, default 0.152
via viaSize (default): diameter min 0.508, default 0.508, max 2.54; hole min 0.203, default 0.305, max 0.508

## Placement (name value [footprint] x y rotation side)
BTN  KT-0805G  [LED0805-R-RD]  14.96 33.58 270 top
C19  100nF  [R0402]  26.08 43.05 135 top
C20  100nF  [R0402]  35.72 41.53 180 top
C21  100nF  [R0402]  30.87 45.59 270 top
C22  100nF  [R0402]  25.63 36.12 0 top
C23  100nF  [R0402]  33.69 34.92 270 top
C25  1uF  [R0402]  25.12 23.17 0 top
C33  10pF  [R0402]  32.29 46.05 0 top
C34  10pF  [R0402]  32.75 43.76 270 top
C40  10uF  [C1206]  37.32 5.13 270 top
C41  10nF  [C0402]  23.09 35.61 270 top
C46  10uF  [C1206]  37.32 10.47 270 top
C47  10uF  [C1206]  22.08 45.26 270 top
C50  1uF  [R0402]  25.32 44.77 225 top
C51  100nF  [C0603]  25.38 18.59 0 top
C52  100nF  [C0603]  24.62 11.73 270 top
C53  10uF  [C1206]  26.65 16.81 0 top
C54  8.2pF  [r0402]  27.92 45.72 270 top
C55  100nF  [C0603]  4.8 22 90 top
C57  10uF  [C1206]  14.67 15.5 90 top
C58  100nF  [C0603]  21.31 15.29 180 top
C59  100uF  [C1206]  16.74 4.11 0 top
C60  100uF  [C1206]  20.04 1.83 180 top
C61  100uF  [C1206]  26.39 13 270 top
CN5  KF250-3.5-2P-1  [CONN-TH_P3.50_KF250-3.5-2P-1]  9.12 45.26 0 top
CN6  KF250-3.5-2P-1  [CONN-TH_P3.50_KF250-3.5-2P-1]  9.12 31.8 0 top
CN7  KF250-3.5-2P-1  [CONN-TH_P3.50_KF250-3.5-2P-1]  9.03 14.33 0 top
D5  PESD1CAN,215  [SOT-23_L2.9-W1.3-P1.90-LS2.4-BR]  19.03 45.01 180 top
D6  SS54  [SMA_L4.4-W2.8-LS5.4-R-RD]  14.96 8.94 270 top
D7  1N5819WS  [SOD-323_L1.8-W1.3-LS2.5-RD]  24.11 4.62 90 top
D8  1N5819WS  [SOD-323_L1.8-W1.3-LS2.5-RD]  27.13 8.82 270 top
H1  HX PH254-01-02-Z-L11.5 male header connector  [HDR-TH_2P-P2.54-V-M_C9900056156]  17.25 25.7 0 top
H2  B-2100S04P-A110  [HDR-TH_4P-P2.54-V-M]  8.87 5.39 180 top
H3  B-2100S04P-A110  [HDR-TH_4P-P2.54-V-M]  32.55 19.29 0 top
L4  2nH  [R0402]  26.9 43.81 315 top
L6  39nH  [r0402]  28.93 44.89 45 top
L7  1.3nH  [r0402]  28.35 47.19 0 top
L8  24nH  [r0402]  32.29 45.14 0 top
L9  15uH  [IND-SMD_L7.0-W6.6_FXL0630]  20.04 9.96 90 top
LED5  KT-0805G  [LED0805-R-RD]  13.44 1.83 180 top
LED6  KT-0805G  [LED0805-R-RD]  9.12 1.83 0 top
LED7  KT-0805G  [LED0805-R-RD]  3.79 1.83 0 top
Q1  AON7544  [DFN-8_L3.2-W3.1-P0.65-LS3.4-BL]  8.99 21.43 90 top
R13  4.7kΩ  [R0402]  6.33 1.32 90 top
R14  4.7kΩ  [R0402]  30.2 25.45 270 top
R15  4.7kΩ  [R0402]  25.12 22.4 180 top
R18  5.1kΩ  [R0402]  28.17 12.5 270 top
R19  5.1kΩ  [R0402]  35.03 7.67 180 top
R26  15kΩ  [R0402]  15.98 2.08 90 top
R27  4.7kΩ  [R0402]  20.55 4.88 180 top
R28  1.5kΩ  [R0402]  20.55 3.86 0 top
R29  15kΩ  [R0402]  6.58 3.1 90 top
R31  15kΩ  [R0402]  14.96 36.88 90 top
R32  220Ω  [R0402]  20.81 32.31 180 top
SW1  TS-1088-AR02016  [SW-SMD_L3.9-W3.0-P4.45]  34.01 25.45 180 top
SW2  TS-1088-AR02016  [SW-SMD_L3.9-W3.0-P4.45]  26.39 25.45 180 top
U2  USB-TYPE-C-019  [TYPE-C-SMD_HX-TYPE-C-16PIN]  30.19 3.84 0 top
U3  ESP32-S3(R8)  [QFN-56_L7.0-W7.0-P0.40-TL-EP4.0]  30.27 39.31 315 top
U5  BY25Q64ASSIG(T)  [SOIC-8_L5.3-W5.3-P1.27-LS8.0-BL]  30.2 31.18 270 top
U14  MCP2562-E/SN  [SOIC-8_L5.0-W4.0-P1.27-LS6.0-BL]  19.79 38.41 0 top
U25  RFANT5220110A0T  [FILTER-SMD_L5.2-W2.0-L]  30.3 49.78 180 top
U26  NCV68061SNAIT1G  [TSOP-6_L3.0-W1.5-P0.95-BL]  14.25 22.24 90 top
U27  TPS5430DDAR  [ESOP-8_L4.9-W3.9-P1.27-LS6.0-TL-EP]  18.77 19.61 270 top
U28  EL3H7(B)(TA)-G  [SSOP-4_L4.4-W2.7-P1.27-LS7.0-TL]  18.52 30.28 180 top
U29  AMS1117-3.3  [SOT-223-3_L6.5-W3.4-P2.30-LS7.0-BR]  31.98 13.51 270 top
X1  40MHz  [crystal-smd_4p-l2.5-w2.0-bl]  35.06 44.32 270 top

## Footprints (pads in the part's own frame, mm; a bottom-side part is the same pattern mirrored in y, then rotated)
C0402
  rect 0.79x0.54 smd: 1(-0.545,0) 2(0.545,0)
C0603
  rect 0.8x0.9 smd: 1(-0.7,0) 2(0.7,0)
C1206
  rect 1.485x1.728 smd: 1(-1.593,0) 2(1.593,0)
CONN-TH_P3.50_KF250-3.5-2P-1
  round 2 hole 1.3: 1(-1.75,2.5) 2(1.75,-2.5)
crystal-smd_4p-l2.5-w2.0-bl
  rect 1.2x1.1 smd: 1(-0.95,-0.75) 2(0.95,-0.75) 3(0.95,0.75) 4(-0.95,0.75)
DFN-8_L3.2-W3.1-P0.65-LS3.4-BL
  rect 0.4x0.6 smd: 1(-0.975,-1.52) 2(-0.325,-1.52) 3(0.325,-1.52) 4(0.975,-1.52) 5(0.975,1.52) 6(0.325,1.52) 7(-0.325,1.52) 8(-0.975,1.52)
  rect 2.6x2.05 smd: 9(0,0.35)
ESOP-8_L4.9-W3.9-P1.27-LS6.0-TL-EP
  rect 1.3x0.6 smd: 1(-2.7,1.905) 2(-2.7,0.635) 3(-2.7,-0.635) 4(-2.7,-1.905) 5(2.7,-1.905) 6(2.7,-0.635) 7(2.7,0.635) 8(2.7,1.905)
  rect 2.5x3.5 smd: 9(0,0)
FILTER-SMD_L5.2-W2.0-L
  rect 1x2 smd: 1(-2.7,0) 2(2.7,0)
HDR-TH_2P-P2.54-V-M_C9900056156
  round 1.5 hole 1: 1(-1.27,0) 2(1.27,0)
HDR-TH_4P-P2.54-V-M
  rect 1.7x1.7 hole 1.1: 1(-3.81,0)
  round 1.7 hole 1.1: 2(-1.27,0) 3(1.27,0) 4(3.81,0)
IND-SMD_L7.0-W6.6_FXL0630
  rect 2.424x3.62 smd: 1(3.128,0) 2(-3.128,0)
LED0805-R-RD
  rect 1x1.399 smd: 1(1.05,0) 2(-1.05,0)
QFN-56_L7.0-W7.0-P0.40-TL-EP4.0
  rect 0.665x0.2 smd: 1(-3.408,2.6) 2(-3.407,2.2) 3(-3.408,1.8) 4(-3.408,1.4) 5(-3.408,1) 6(-3.407,0.6) 7(-3.408,0.2) 8(-3.408,-0.2) 9(-3.407,-0.6) 10(-3.408,-1) 11(-3.408,-1.4) 12(-3.408,-1.8) 13(-3.407,-2.2) 14(-3.408,-2.6) 29(3.408,-2.6) 30(3.407,-2.2) 31(3.408,-1.8) 32(3.408,-1.4) 33(3.408,-1) 34(3.407,-0.6) 35(3.408,-0.2) 36(3.408,0.2) 37(3.407,0.6) 38(3.408,1) 39(3.408,1.4) 40(3.408,1.8) 41(3.407,2.2) 42(3.408,2.6)
  rect 0.2x0.665 smd: 15(-2.6,-3.408) 16(-2.2,-3.407) 17(-1.8,-3.408) 18(-1.4,-3.408) 19(-1,-3.408) 20(-0.6,-3.407) 21(-0.2,-3.408) 22(0.2,-3.408) 23(0.6,-3.407) 24(1,-3.408) 25(1.4,-3.408) 26(1.8,-3.408) 27(2.2,-3.407) 28(2.6,-3.408) 43(2.6,3.408) 44(2.2,3.407) 45(1.8,3.408) 46(1.4,3.408) 47(1,3.408) 48(0.6,3.407) 49(0.2,3.408) 50(-0.2,3.408) 51(-0.6,3.407) 52(-1,3.408) 53(-1.4,3.408) 54(-1.8,3.408) 55(-2.2,3.407) 56(-2.6,3.408)
  rect 4x4 smd: 57(0,0)
R0402
  rect 0.566x0.54 smd: 1(-0.433,0) 2(0.433,0)
r0402
  rect 0.566x0.54 smd: 1(-0.433,0) 2(0.433,0)
SMA_L4.4-W2.8-LS5.4-R-RD
  rect 2.062x1.539 smd: 1(2.503,0) 2(-2.503,0)
SOD-323_L1.8-W1.3-LS2.5-RD
  rect 1x0.75 smd: 1(-1.173,0) 2(1.173,0)
SOIC-8_L5.0-W4.0-P1.27-LS6.0-BL
  oval 0.569x1.95 smd: 1(-1.905,-2.705) 2(-0.635,-2.705) 3(0.635,-2.705) 4(1.905,-2.705) 5(1.905,2.705) 6(0.635,2.705) 7(-0.635,2.705) 8(-1.905,2.705)
SOIC-8_L5.3-W5.3-P1.27-LS8.0-BL
  oval 0.63x2.25 smd: 1(-1.905,-3.53) 2(-0.635,-3.53) 3(0.635,-3.53) 4(1.905,-3.53) 5(1.905,3.53) 6(0.635,3.53) 7(-0.635,3.53) 8(-1.905,3.53)
SOT-23_L2.9-W1.3-P1.90-LS2.4-BR
  rect 1x0.8 smd: 1(1.15,-0.95) 2(1.15,0.95) 3(-1.15,0)
SOT-223-3_L6.5-W3.4-P2.30-LS7.0-BR
  rect 2.5x1.1 smd: 1(2.97,-2.3) 2(2.97,0) 3(2.97,2.3)
  rect 2.34x3.6 smd: 4(-2.97,0)
SSOP-4_L4.4-W2.7-P1.27-LS7.0-TL
  rect 1.5x0.6 smd: 1(-3.175,0.635) 2(-3.175,-0.635) 3(3.175,-0.635) 4(3.175,0.635)
SW-SMD_L3.9-W3.0-P4.45
  rect 1.23x1.86 smd: 1(-2.185,0) 2(2.185,0)
TSOP-6_L3.0-W1.5-P0.95-BL
  rect 0.532x1.095 smd: 1(-0.95,-1.147) 2(0,-1.147) 3(0.95,-1.147) 4(0.95,1.147) 5(0,1.147) 6(-0.95,1.147)
TYPE-C-SMD_HX-TYPE-C-16PIN
  oval 1x2 hole 0.6x1.7: 1(-4.32,1.816) 1(4.32,1.816)
  oval 1x1.8 hole 0.6x1.4: 1(-4.32,-2.384) 1(4.32,-2.384)
  rect 0.5x1.14 smd: A1(-3.2,2.384) A4(-2.4,2.384) A9(2.4,2.384) A12(3.2,2.384)
  rect 0.3x1.14 smd: A5(-1.25,2.383) A6(-0.25,2.383) A7(0.25,2.383) A8(1.25,2.384) B5(1.75,2.383) B6(0.75,2.383) B7(-0.75,2.383) B8(-1.75,2.384)

## Nets
As in the schematic, except:
GPIO18: BTN.1 R32.1 U3.24
$1N49044: BTN.2 R31.1

Pads without a net: U2 A8 B8; U25 1; U26 1; U27 2 3 5

## Via types
v1: diameter 0.508, hole 0.305, Top Layer to Bottom Layer, 162 vias

## Routing (per net, layer and track width the routed paths; a pad name or vN(x,y) marks a point on that pad's centre or on a via; arc(x,y) is an arc through that point)
3V3: length 142.9
  Top Layer w0.152: 34.93,41.17 C20.2 ; 33.67,40.73 33.72,40.78 arc(34.02,40.98) 34.37,41.05 34.62,41.05 arc(34.72,41.06) 34.81,41.09 arc(34.87,41.13) 34.93,41.17 ; 24.44,21.72 24.69,21.97 R15.2
  Top Layer w0.203: 31.2,44.03 31.2,44.04 arc(31.18,44.16) 31.14,44.28 ; 31.2,44.03 arc(31.22,44.11) 31.22,44.2 ; 31.2,44.03 arc(31.14,43.88) 31.04,43.75 U3.56 ; 31.5,44.12 v1(31.25,44.37) 31.01,44.61 arc(30.98,44.63) 30.94,44.64 ; 31.5,44.12 31.5,43.92 ; 31.5,44.12 arc(31.45,44.35) 31.32,44.55 30.97,44.9 arc(30.89,45.02) C21.2 30.87,45.05 arc(30.88,44.85) 30.94,44.64 ; 27.43,37.32 26.23,36.12 C22.2 ; 31.5,43.92 31.22,44.2 ; 31.5,43.92 arc(31.45,43.67) 31.31,43.46 U3.55 ; 31.22,44.2 arc(31.18,44.24) 31.14,44.28 ; 31.03,44.44 30.79,44.68 arc(30.72,44.78) 30.7,44.9 ; 31.03,44.44 arc(31.1,44.36) 31.14,44.28 ; 31.03,44.44 arc(31.09,44.36) 31.14,44.28 ; 31.03,44.44 arc(30.98,44.54) 30.94,44.64
  Top Layer w0.254: 23.87,43.28 23.71,43.28 ; C53.2 26.46,18.59 C51.2 ; v1(16.74,2.51) 16.74,8.18 18.52,9.96 21.57,9.96 22.84,11.23 22.84,13.77 23.78,14.71 v1(23.78,15.42) ; 24.12,43.53 24.12,43.55 ; C22.2 26.07,35.59 25.32,34.85 24.62,34.85 v1(24.36,34.59) ; R14.2 30.2,24.26 31.08,24.26 31.1,24.24 32.56,24.24 34.27,25.95 34.27,27.26 36.05,29.04 36.05,39.85 34.81,41.09 ; 23.67,43.24 21.7,41.27 U14.5
  Top Layer w0.508: 26.59,44.15 25.8,43.36 C19.2 24.85,44.28 ; v1(23.73,43.18) 24.83,44.28 24.85,44.28 ; U29.4 33.82,18.32 H3.3 30.2,22.91 30.2,24.26 29.37,23.42 27.92,23.42 26.14,21.64 v1(24.36,21.64) ; C50.2 25.01,44.44 24.85,44.28 ; C47.2 23.24,43.67 23.67,43.24
  Top Layer w0.762: 31.85,15.85 30.89,16.81 C53.2 ; 31.85,15.85 31.85,16.35 U29.4 ; 31.85,15.85 31.98,15.72 U29.2
  Bottom Layer w0.254: v1(34.78,41.12) 34.78,41.2 35.28,41.71 35.28,42.72 33.64,44.37 v1(31.25,44.37) ; v1(16.74,2.51) 10.47,2.51 ; 10.47,2.51 H2.3 ; 10.47,2.51 8.28,2.51 v1(6.33,0.56)
  Bottom Layer w0.305: v1(24.36,21.64) 23.9,21.18 23.85,21.18
  Bottom Layer w0.508: v1(23.78,15.42) 23.85,15.49 23.85,32.06 24.36,32.56 v1(24.36,34.59) 24.36,42.47 23.73,43.1 v1(23.73,43.18)
+5V: length 75.7
  Top Layer w0.254: v1(23.09,33.86) 23.09,34.59 ; 23.09,34.59 22.58,34.09 20.81,34.09 20.43,34.47 U14.3 ; 23.09,34.59 C41.2 ; C52.2 26.02,11.03 C61.2 ; 10.17,2.08 10.17,5.35 H2.2 ; 23.44,3.45 D7.1
  Top Layer w0.508: D8.1 27.39,10
  Top Layer w0.762: C40.1 C46.2 35.65,10.54 U29.3 34.28,9.27 33.54,8.53 28.85,8.53 27.39,10 ; v1(26.6,10.96) 27.13,10.42 D8.1
  Bottom Layer w0.254: H2.2 12.17,3.35 v1(23.35,3.35) 23.6,3.61 23.6,9.96 24.6,10.96
  Bottom Layer w0.508: v1(26.6,10.96) 24.61,10.96 22.78,12.78 22.78,33.5 23.09,33.81 v1(23.09,33.86)
+12V: length 30.4
  Top Layer w0.254: 12.39,2.08 12.68,2.37 H2.1 12.68,14.28 14.46,16.05 14.46,16.88 C57.2
  Top Layer w0.508: 10.51,20.46 Q1.2 Q1.3
  Top Layer w0.762: U27.7 19.41,15.93 18.77,15.29 16.47,15.29 C57.2
  Top Layer w1.27: 10.51,20.46 11.08,19.89 13.28,19.89 14.67,18.49 C57.2
GND: length 23.4
  Top Layer w0.203: v1(30.2,42.8) 30.27,42.87 30.27,43.88 v1(30.2,43.94)
  Top Layer w0.254: 32.75,43.33 arc(32.89,43.3) 33,43.23 33.62,42.61 arc(33.63,42.59) 33.63,42.57 33.78,42.42 arc(34.06,42.24) 34.39,42.17 34.39,43.17 arc(34.37,43.28) X1.2
  Top Layer w0.35: 28.78,47.19 29.06,46.92 v1(29.06,46.38)
  Top Layer w0.381: 36.02,46.48 v1(35.28,46.48) 34.39,46.48 arc(34.24,46.47) 34.09,46.42 ; 36.02,46.48 v1(36.43,46.48) ; 36.02,46.48 arc(36.21,46.46) 36.39,46.4 arc(36.77,46.07) 36.91,45.59 36.91,45.27 ; 34.39,42.17 36.26,42.17 arc(36.72,42.36) 36.91,42.82 36.91,45.27 ; v1(31.73,46.79) 31.73,46.35 arc(31.76,46.19) C33.1 ; v1(33,35.18) 33.51,35.18 C23.1 ; 36.91,45.27 X1.4 ; v1(33.32,46.7) 33.35,46.66 arc(33.55,46.53) 33.79,46.48 v1(34.07,46.48) ; v1(30.84,46.79) 30.84,46.09 arc(30.85,46.05) C21.1 ; L6.2 29.47,45.43 arc(29.64,45.68) v1(29.7,45.97) ; C50.1 26.05,45.5 arc(26.12,45.6) v1(26.14,45.72) arc(26.21,45.73) 26.27,45.77
  Top Layer w0.508: C59.1 15.15,6.25 14.96,6.44
  vias: v1(1.56,1.83) v1(4.8,17.58) v1(5.06,19.61) v1(7.09,23.93) v1(8.49,46.08) v1(8.49,41) v1(8.49,35.92) v1(8.49,30.84) v1(8.49,25.76) v1(8.49,15.6) v1(8.49,10.52) v1(8.65,23.5) v1(9.38,19.36) v1(9.48,18.05) v1(11.83,23.19) v1(13.57,46.08) v1(13.57,41) v1(13.57,35.92) v1(13.57,25.76) v1(13.57,10.52) v1(14.96,8.02) v1(16.49,18.85) v1(16.67,9.96) v1(16.74,0.81) v1(17.5,6.91) v1(18.65,30.84) v1(19.28,34.34) v1(19.79,19.36) v1(20.04,8.99) v1(21.06,10.97) v1(21.27,18.81) v1(21.31,23.67) v1(22.01,48.96) v1(22.33,9.19) v1(22.71,40.5) v1(22.91,1.66) v1(23.09,36.63) v1(23.75,50.14) v1(23.75,49.05) v1(23.74,48.07) v1(23.73,46.74) v1(23.73,46.08) v1(23.79,45.4) v1(23.83,51) v1(24.68,46.29) v1(24.69,45.44) v1(24.62,13) v1(25.19,2.86) v1(25.38,20.37) v1(25.45,45.95) v1(25.51,42.42) v1(25.76,27.11) v1(25.89,46.74) v1(26.1,14.32) v1(26.22,28.09) v1(26.46,2.86) v1(26.65,45.21) v1(27.13,44.68) v1(27.19,13) v1(27.54,24.51) v1(27.79,44.2) v1(27.72,39.32) v1(27.73,2.86) v1(27.73,1.65) v1(28.26,39.84) v1(28.32,38.71) v1(28.81,28.07) v1(28.96,40.54) v1(29.03,38) v1(29,2.86) v1(29,1.65) v1(29.67,41.25) v1(29.7,44.45) v1(29.74,37.3) v1(29.82,46.66) v1(30.08,45.34) v1(30.28,41.86) v1(30.27,2.86) v1(30.27,1.65) v1(30.45,36.59) v1(30.61,30.8) v1(30.8,41.32) v1(30.97,37.19) v1(31.5,40.61) v1(31.54,2.86) v1(31.54,1.65) v1(31.68,37.89) v1(32.03,30.86) v1(32.21,39.9) v1(32.39,38.6) v1(32.49,46.79) v1(32.81,2.86) v1(32.81,1.65) v1(33.05,27.1) v1(33.3,26.36) v1(34.08,4.25) v1(34.08,2.86) v1(34.16,13.55) v1(34.39,15.6) v1(34.78,37.85) v1(35.32,25.06) v1(35.35,4.25) v1(35.35,2.86) v1(35.35,1.84) v1(36.3,51.09) v1(36.33,50.14) v1(36.3,49.07) v1(36.3,48.32) v1(36.36,47.37) v1(38.97,46.08) v1(38.97,41) v1(38.97,35.92) v1(38.97,30.84) v1(38.97,25.76) v1(38.97,20.68) v1(38.97,15.6) v1(38.97,10.52) v1(38.97,5.44)
VDD_SPI: length 5.7
  Top Layer w0.152: U3.29 31.38,34.52 arc(31.54,34.27) 31.6,33.98 31.6,33.61 arc(31.63,33.45) 31.69,33.31 arc(31.75,33.24) 31.83,33.18 arc(31.97,33.11) 32.12,33.08 U5.8 33.69,33.13 33.69,34.62
9-16V: length 19
  Top Layer w0.203: U26.3 14.43,23.19 14.2,23.42 ; 14.2,23.42 14.2,21.89 13.6,21.29 13.1,21.29 ; 14.2,23.42 13.91,23.71 10.17,23.71 8.64,22.17 Q1.9
  Top Layer w0.508: C55.2 5.09,22.41 Q1.5
  Top Layer w1.27: Q1.5 Q1.6
  Top Layer w2.54: 7.47,20.46 7.28,20.27 CN7.1 ; Q1.6 Q1.7
CAN_H: length 10.5
  Top Layer w0.254: CN5.2 11.85,43.74 17.76,43.74 19.16,42.34 U14.7
CAN_L: length 17.5
  Top Layer w0.254: U14.6 20.55,41.24 20.55,43.23 15.64,48.14 7.75,48.14 CN5.1
CHIP_PU: length 26.3
  Top Layer w0.152: U3.4 29.13,42.42 arc(29.28,42.33) 29.45,42.29 v1(29.57,42.29) ; C25.2 R15.1 ; 25.65,22.99 25.65,24.89 arc(25.52,25.21) 25.2,25.34 24.93,25.34 arc(24.71,25.43) 24.61,25.66 24.61,27.37 arc(24.65,27.54) v1(24.74,27.69)
  Bottom Layer w0.152: v1(29.57,42.29) 28.63,43.23 27.41,43.23 25.12,40.94 25.12,28.07 v1(24.74,27.69)
GPIO0: length 24.9
  Top Layer w0.152: 28.57,42.42 28.84,42.15 arc(28.91,42.04) 28.93,41.92 v1(28.93,41.66)
  Top Layer w0.254: v1(28.17,26.97) 29.11,26.97 R14.1 31.4,25.88 SW1.2
  Bottom Layer w0.152: 27.47,27.74 25.38,29.84 25.38,40.69 27.41,42.72 27.87,42.72 v1(28.93,41.66)
  Bottom Layer w0.254: v1(28.17,26.97) 28.17,27.04 27.47,27.74
GPIO10: length 10.3
  Top Layer w0.254: U14.1 17.89,37.26 18.52,37.9 25.18,37.9 U3.15
GPIO11: length 6.4
  Top Layer w0.254: U14.4 21.7,36.75 22.33,37.39 25.24,37.39 U3.16
GPIO18: length 17
  Top Layer w0.254: 21.31,32.56 21.31,32.64 20.88,33.07 ; 21.31,32.56 21.31,32.38 21.39,32.31 ; 21.31,32.56 21.82,33.07 ; 20.88,33.07 15.25,33.07 14.96,32.78 BTN.1 ; 20.88,33.07 21.82,33.07 ; 21.82,33.07 24.36,33.07 26.24,34.95 27.33,34.95 28.57,36.19
SPICLK: length 9.1
  Top Layer w0.152: U5.6 34.54,30.54 35.09,31.1 35.09,35.05 34.27,35.86 34.06,35.86 34.05,35.87 33.32,35.87 33.32,35.86 32.3,35.86 U3.33
SPICS0: length 8.2
  Top Layer w0.152: U3.32 32.13,35.46 arc(32.21,35.34) v1(32.24,35.2) ; U5.1 27.22,33.08 27.28,33.15 v1(28.3,33.15)
  Bottom Layer w0.152: v1(32.24,35.2) 31.73,34.69 31.73,33.33 31.55,33.15 v1(28.3,33.15)
SPID: length 11.1
  Top Layer w0.152: U5.5 34.28,29.27 35.54,30.53 35.54,35.96 35.09,36.41 32.88,36.41 U3.35
SPIHD: length 7.2
  Top Layer w0.152: U5.7 32.11,31.81 arc(31.82,31.87) 31.57,32.04 31.44,32.16 arc(31.28,32.41) 31.22,32.7 31.22,33.79 arc(31.16,34.08) 31,34.33 30.39,34.94 arc(30.3,35.08) 30.26,35.24 30.26,35.36 arc(30.29,35.48) 30.36,35.58 arc(30.47,35.66) 30.6,35.69 30.65,35.69 arc(30.77,35.66) 30.87,35.6 U3.30
SPIQ: length 13.5
  Top Layer w0.152: U5.2 v1(28.3,31.81) ; U3.34 32.57,36.15 34.66,36.15 v1(34.99,35.83)
  Bottom Layer w0.152: v1(34.99,35.83) 34.99,34.93 31.87,31.81 v1(28.3,31.81)
SPIWP: length 10.7
  Top Layer w0.152: v1(28.05,30.86) 27.73,30.54 U5.3 ; v1(32.34,33.99) 32.34,34.24 31.76,34.82 31.76,35.27 U3.31
  Bottom Layer w0.152: v1(32.34,33.99) 32.34,33.17 31.46,32.3 28.1,32.3 27.66,31.86 27.66,31.24 v1(28.05,30.86)
SWITCH: length 9.9
  Top Layer w0.508: U28.4 14.08,29.64 9.42,34.3 CN6.1
SWITCH_GND: length 14
  Top Layer w0.508: CN6.2 12.89,29.3 15.98,26.21 H1.1 17,26.72 17,30.53 16.62,30.91 U28.3
U0RX: length 30.6
  Top Layer w0.152: v1(33.75,39.02) 33.75,39.07 arc(33.7,39.29) 33.58,39.47 32.37,40.68 arc(32.22,40.9) 32.17,41.16 32.17,41.36 arc(32.2,41.48) 32.27,41.59 U3.50
  Bottom Layer w0.152: v1(33.75,39.02) 34.11,38.66 34.78,38.66 36.81,36.63 36.81,23.42 35.79,22.4 31.86,22.4 H3.1
U0TX: length 29.5
  Top Layer w0.152: v1(34.78,39.33) 34.44,39.33 arc(34.15,39.38) 33.9,39.55 32.58,40.87 arc(32.51,40.97) 32.48,41.1 arc(32.51,41.23) 32.58,41.34 U3.49
  Bottom Layer w0.152: H3.2 31.28,20.94 32.24,21.89 36.15,21.89 37.32,23.06 37.32,36.78 v1(34.78,39.32)
USB_D+: length 35.9
  Top Layer w0.241: U2.B6 30.94,7.16 30.86,7.24 v1(30.71,7.24) 30.03,7.24 29.94,7.15 U2.A6 ; 29.13,35.62 28.81,35.3 28.81,34.85 arc(28.86,34.56) 29.03,34.31 29.6,33.74 arc(29.77,33.49) 29.82,33.2 29.82,30.19 arc(29.77,29.9) 29.6,29.65 27.03,27.08 arc(26.84,26.8) 26.78,26.47 26.82,26.43 v1(26.82,26.03)
  Bottom Layer w0.241: v1(26.82,26.03) 26.82,17.16 30.42,13.55 30.42,13.22 29.95,12.75 29.95,12.24 30.46,11.73 30.46,11.23 29.95,10.72 29.95,10.21 30.46,9.7 30.46,9.19 29.95,8.69 29.95,8.32 30.71,7.56 v1(30.71,7.24)
USB_D-: length 35.8
  Top Layer w0.241: v1(29.44,7.49) 29.44,5.36 29.59,5.21 30.27,5.21 30.44,5.38 30.44,6.23 ; U3.25 28.55,35.61 28.55,35.6 28.41,35.47 28.41,34.69 arc(28.47,34.39) 28.63,34.15 29.21,33.57 arc(29.37,33.33) 29.43,33.04 29.43,30.35 arc(29.37,30.06) 29.21,29.81 26.47,27.08 arc(26.27,26.77) 26.2,26.41 26.14,26.36 26.14,26.17
  Bottom Layer w0.241: v1(26.16,26.26) 26.16,17.05 29.44,13.77 v1(29.44,7.49)
VUSB: length 1.7
  Top Layer w0.508: 27.84,6.21 27.77,6.28 27.77,6.96 27.11,7.63 27.11,7.65
XTAL_N: length 6
  Top Layer w0.203: U3.53 31.91,42.93 arc(32.11,43.23) 32.19,43.59 32.19,43.96 arc(32.25,44.13) 32.42,44.2 C34.1 32.85,44.3 35.59,44.3 35.81,44.08 X1.3
XTAL_P: length 2.4
  Top Layer w0.203: 34.17,45.14 L8.2 C33.2
$1N15135: length 3.7
  Top Layer w0.203: 28.81,43.69 28.63,43.51 28.63,43.49 28.75,43.37 ; 28.81,43.69 29,43.69 U3.2 ; 28.81,43.69 28.43,43.69 ; 28.75,43.37 28.49,43.37 ; 28.75,43.37 29.13,42.99
  Top Layer w0.508: L4.2 27.22,43.52 28.49,43.52
$1N27024: length 2.4
  Top Layer w0.203: U3.1 29.3,43.95
  Top Layer w0.35: L6.1 27.93,45.29 27.92,45.29 ; 28.69,44.56 29.3,43.95
$1N27033: length 3.8
  Top Layer w0.35: C54.1 L7.1 ; U25.2 27.92,49.46 27.92,47.19
$1N27209: length 2.3
  Top Layer w0.203: L8.1 31.85,43.6 arc(31.82,43.45) 31.74,43.32 U3.54
$1N43290: length 3.6
  Top Layer w0.254: R32.2 20.3,32.23 20.3,30.53 21.19,29.64 U28.1
$1N49044: length 1.8
  Top Layer w0.254: R31.1 14.96,34.63
$2N732: length 2.7
  Top Layer w0.508: 13.1,22.24 12.93,22.41 Q1.4
$2N1490: length 8.8
  Top Layer w0.508: C58.1 22.01,16.5 23.35,17.83 23.35,19.86 20.9,22.31 U27.1
$2N1528: length 9.8
  Top Layer w0.508: L9.1 20.49,13.53 20.49,15.29 20.68,15.48 U27.8
  Top Layer w0.762: L9.1 18.4,11.44 D6.2
$2N1537: length 24.1
  Top Layer w0.254: v1(17.25,23.67) 16.87,23.29 U27.4 ; v1(21.7,5) 21.57,4.88 R27.1 R28.2
  Bottom Layer w0.254: v1(17.25,23.67) 17.76,23.67 18.01,23.42 18.01,8.69 v1(21.7,5)
$2N1737: length 10.9
  Top Layer w0.762: D7.2 22.58,5.8 21.55,6.83 L9.2 20.12,6.75 R27.2 19.1,4.88 C59.2 18.34,1.83
$2N3472: length 1.7
  Top Layer w0.254: R26.1 14.92,1.65 14.49,2.08
$2N3518: length 1.7
  Top Layer w0.254: 8.07,2.08 7.17,2.08 R29.1
$2N3567: length 1.5
  Top Layer w0.254: R13.2 6.25,1.83 LED7.1
$3N397: length 7.3
  Top Layer w0.152: U2.A5 28.93,6.22 v1(28.93,5.08)
  Top Layer w0.254: U2.A5 28.94,6.9 v1(28.43,7.42) ; v1(28.17,11.23) R18.2
  Bottom Layer w0.254: v1(28.43,7.42) 28.43,10.97 v1(28.17,11.23)
$3N411: length 4
  Top Layer w0.254: 34.6,7.92 34.34,7.67 32.24,7.67 31.98,7.42 31.98,6.27 U2.B5

## Copper pours and planes (outline as drawn; the poured copper is in the pictures)
GND on Top Layer: -1.58,51.7 41.6,51.7 41.6,0 -1.58,0
GND on Bottom Layer: -3.15,51.19 40.11,51.19 40.11,-0.51 -3.15,-0.51
VUSB on Top Layer: 27.47,6.88 28.11,6.89 28.11,5.51 28.79,4.83 31.47,4.83 32.3,5.65 32.3,6.73 32.36,6.79 32.81,6.79 32.87,6.73 32.87,3.87 32.43,3.43 28.05,3.43 27.47,4.01

## Text on the board
Bottom Silkscreen Layer: Button / IN  GND | CAN / L  H | PWR / +  - | CAN Engage PCB / Designed by Balázs Gunics / for AgOpen.shop / github.com/gunicsba / 2026.01.01 V0.1
Top Silkscreen Layer: GND 3V3 5V 12V | SW / GND | ESP32S3 8Mb | SW / +- | P / W / R / +- | C / A / N / LH | RX  TX  3V3 GND | RST | BOOT
